# Altium project System Control.PrjPCB (part 1 of 3)
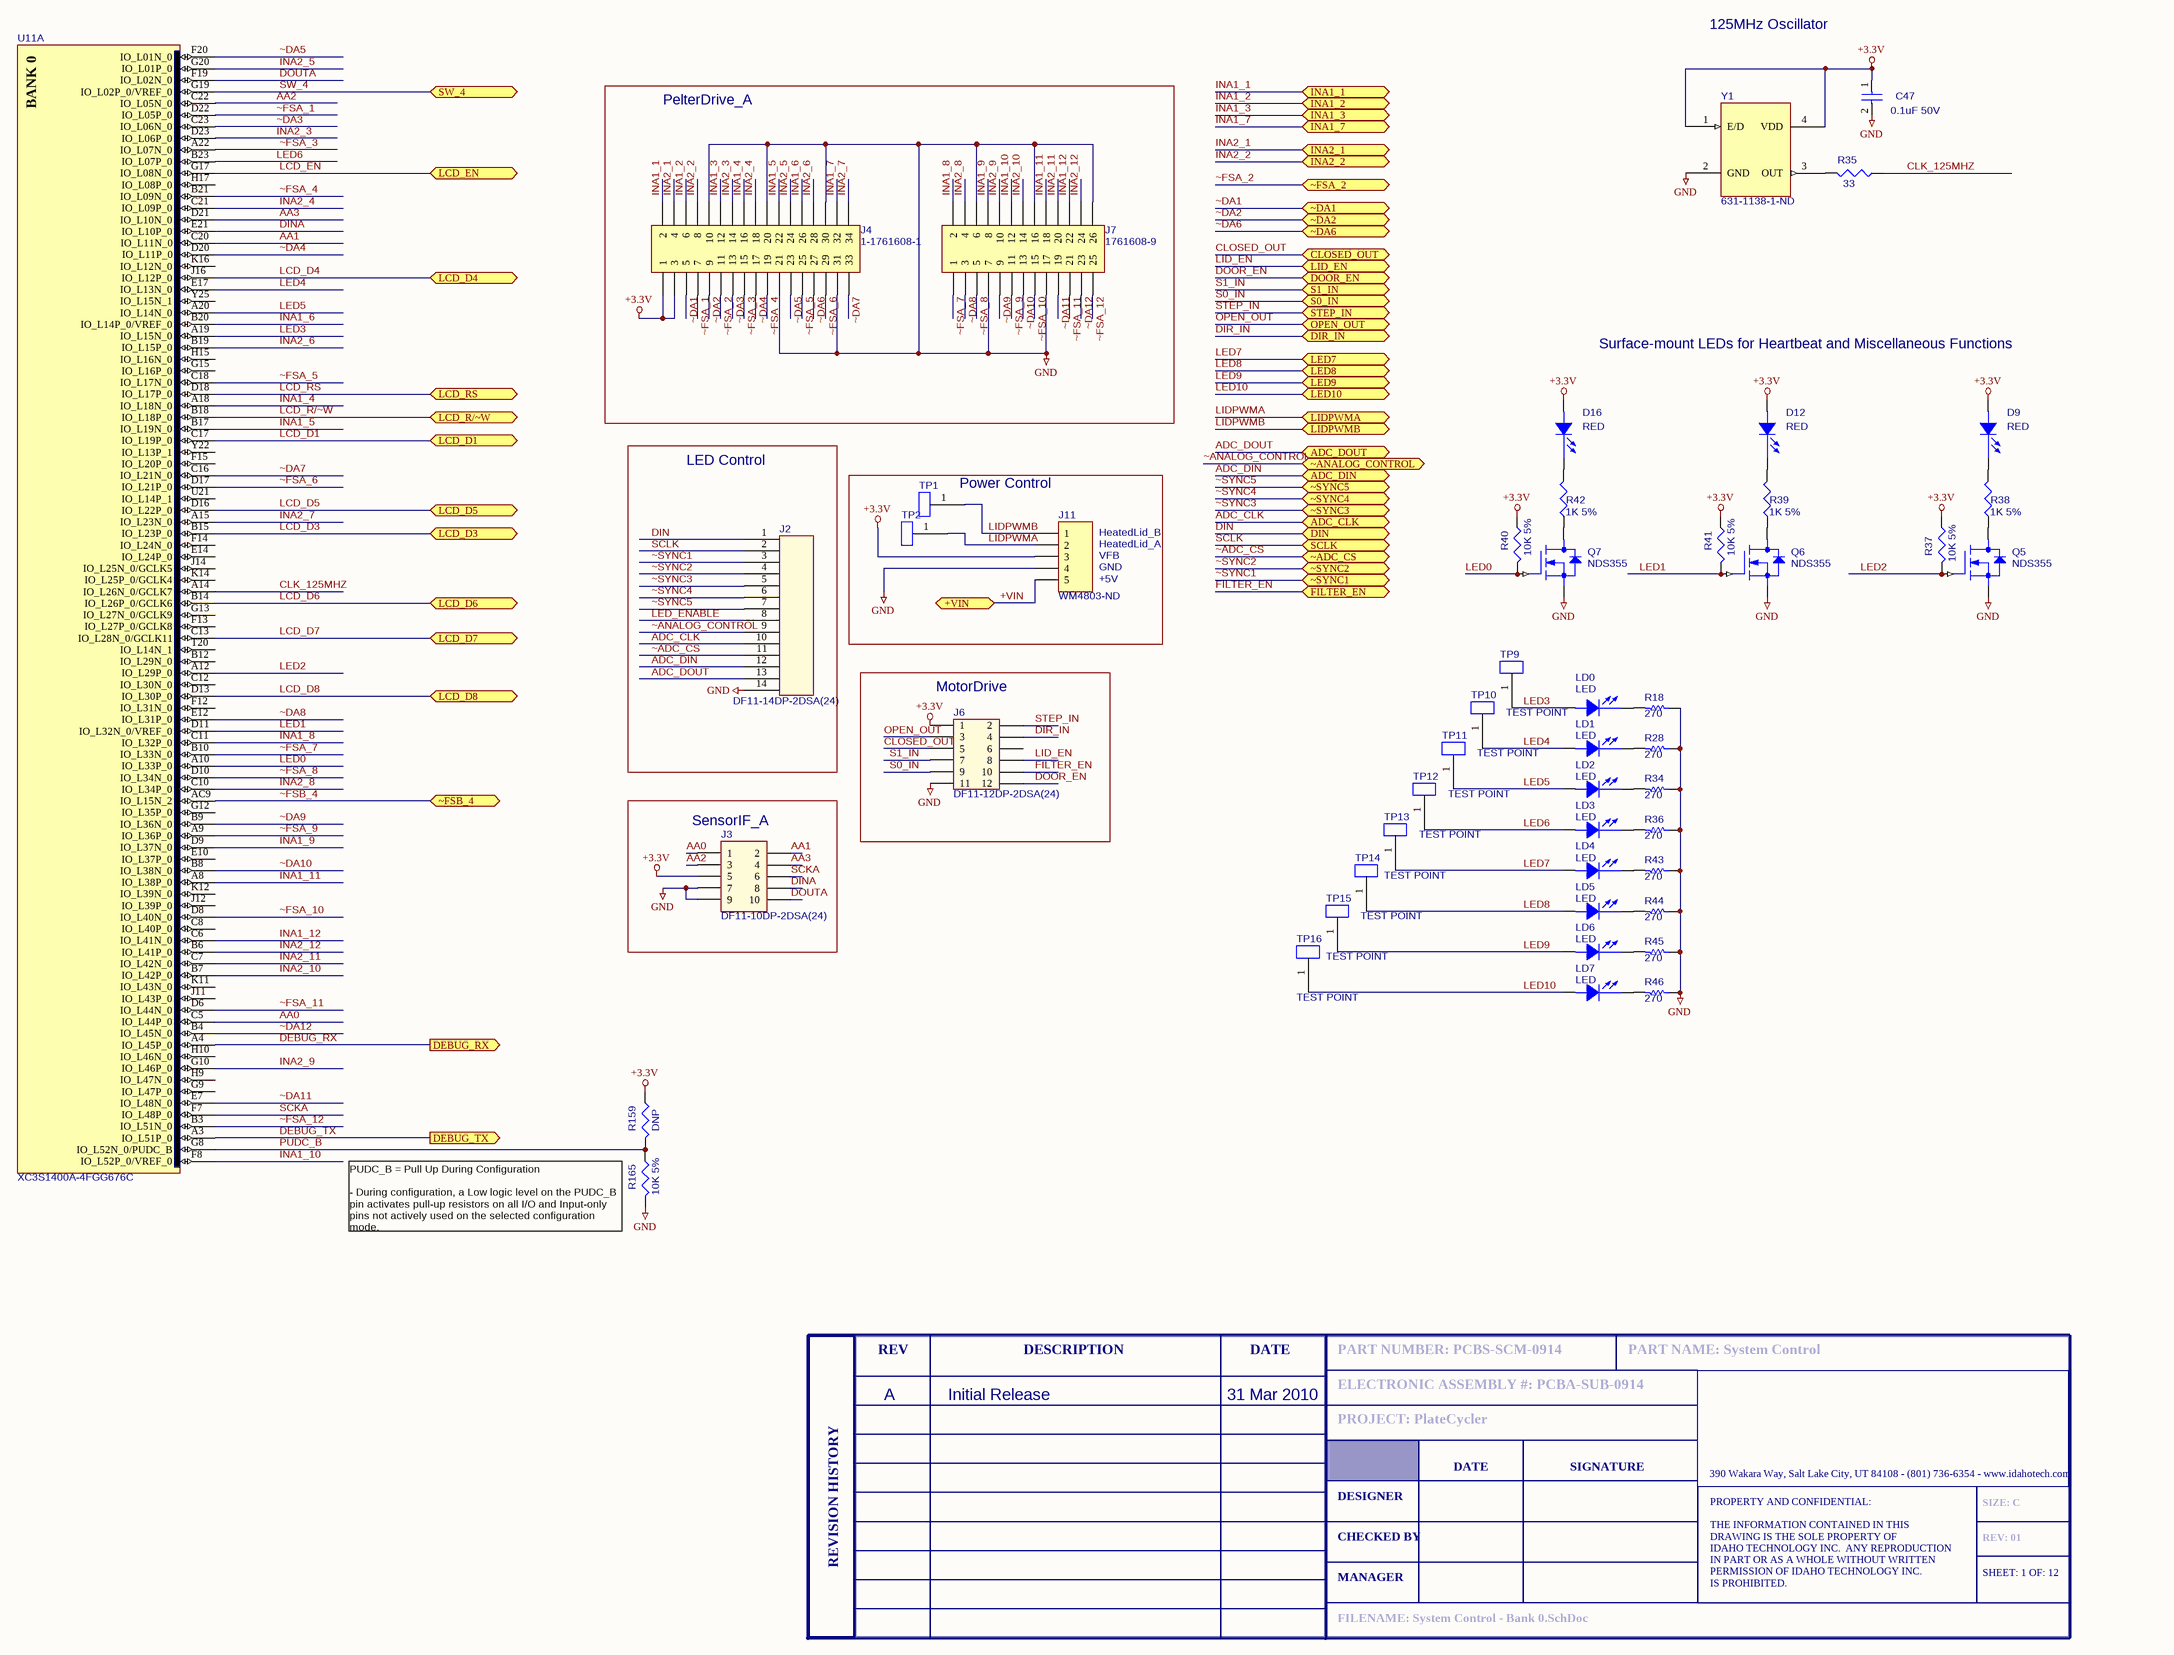
[diagram p0: System Control - Bank0.SchDoc]
Assembly P/N: PCBA-SUB-0914; BOM P/N: PCBS-BOM-0914; BOM Title: FPGA PlateCycler BOM; Project: PlateCycler; Revision Number: C
12 sheets, 515 parts. Net scope: global (net labels, ports and power ports of the same name join across sheets).
Board file: System Control.PcbDoc
Sheets:
  System Control - Bank0.SchDoc
  System Control - Bank1.SchDoc
  System Control - Bank2.SchDoc
  System Control - Bank3.SchDoc
  System Control - FPGA Supply and Configuration.SchDoc
  System Control - Mode DIP Switch.SchDoc
  System Control - Parallel Flash.SchDoc
  System Control - Power Supervisors.SchDoc
  System Control - Power.SchDoc
  System Control - SDRAM.SchDoc
  System Control - Serial Flash.SchDoc
  System Control - Serial Port.SchDoc

## Sheet System Control - Bank0.SchDoc
size C

### Parts
(Parts that share a designator on the sheet are numbered #1, #2 ... from top to bottom, then left to right.)
C47  0.1uF 50V  [SM/C_0603]
D9  RED  [LED 1206]
D12  RED  [LED 1206]
D16  RED  [LED 1206]
J2  Manufacturer P/N: DF11-14DP-2DSA(24)  [HEADER_2X7_1]  (hidden comment: LED Driver)
J3  Manufacturer P/N: DF11-10DP-2DSA(24)  [HEADER_2X5_1]  (hidden comment: Sensor I/F A)
J4  Manufacturer P/N: 1-1761608-1  [HEADER_2X17_2]
J6  Manufacturer P/N: DF11-12DP-2DSA(24)  [HEADER_2X6_1]  (hidden comment: Motor Drive)
J7  Manufacturer P/N: 1761608-9  [HEADER_2X13_2]
J11  Vendor P/N: WM4803-ND  [HDR1X5]  (hidden comment: PWR CONTROL)
LD0  LED  [SM/D_0603]
LD1  LED  [SM/D_0603]
LD2  LED  [SM/D_0603]
LD3  LED  [SM/D_0603]
LD4  LED  [SM/D_0603]
LD5  LED  [SM/D_0603]
LD6  LED  [SM/D_0603]
LD7  LED  [SM/D_0603]
Q5  NDS355  [TO236AA/SOT23]
Q6  NDS355  [TO236AA/SOT23]
Q7  NDS355  [TO236AA/SOT23]
R18  value 270  [0603]  (hidden comment: Res1)
R28  value 270  [0603]  (hidden comment: Res1)
R34  value 270  [0603]  (hidden comment: Res1)
R35  33  [SM/R_0603]
R36  value 270  [0603]  (hidden comment: Res1)
R37  10K 5%  [SM/R_0603]
R38  1K 5%  [SM/R_0603]
R39  1K 5%  [SM/R_0603]
R40  10K 5%  [SM/R_0603]
R41  10K 5%  [SM/R_0603]
R42  1K 5%  [SM/R_0603]
R43  value 270  [0603]  (hidden comment: Res1)
R44  value 270  [0603]  (hidden comment: Res1)
R45  value 270  [0603]  (hidden comment: Res1)
R46  value 270  [0603]  (hidden comment: Res1)
R159  DNP  [SM/R_0603]  (no BOM)
R165  10K 5%  [SM/R_0603]
T?#1  SIZE: C  REV: 01  FILENAME: System Control - Bank 0.SchDoc  PART NUMBER: PCBS-SCM-0914  PART NAME: System Control  ELECTRONIC ASSEMBLY #: PCBA-SUB-0914  PROJECT: PlateCycler  SHEET: 1  OF: 12  (hidden comment: ITI Title Block)  (graphical)
TP1  LID B PWM  [BLKCON.100/VH/TM1SQ/W.100/1]  (value not drawn)
TP2  LID A PWM  [BLKCON.100/VH/TM1SQ/W.100/1]  (value not drawn)
TP9  TEST POINT  [BLKCON.100/VH/TM1SQ/W.100/1]
TP10  TEST POINT  [BLKCON.100/VH/TM1SQ/W.100/1]
TP11  TEST POINT  [BLKCON.100/VH/TM1SQ/W.100/1]
TP12  TEST POINT  [BLKCON.100/VH/TM1SQ/W.100/1]
TP13  TEST POINT  [BLKCON.100/VH/TM1SQ/W.100/1]
TP14  TEST POINT  [BLKCON.100/VH/TM1SQ/W.100/1]
TP15  TEST POINT  [BLKCON.100/VH/TM1SQ/W.100/1]
TP16  TEST POINT  [BLKCON.100/VH/TM1SQ/W.100/1]
U11  XC3S1400A-4FGG676C  [FGG676]  (part A of 9)
Y1  Vendor P/N: 631-1138-1-ND  [FXO_HC73]  (hidden comment: 125 MHz)

### Blocks framed on the sheet
PelterDrive_A: J4 J7
LED Control: J2
Power Control: J11 TP1 TP2
MotorDrive: J6
SensorIF_A: J3

### Ports
+VIN, ADC_CLK, ADC_DIN, ADC_DOUT, CLOSED_OUT, DEBUG_RX, DEBUG_TX, DIN, DIR_IN, DOOR_EN, FILTER_EN, INA1_1, INA1_2, INA1_3, INA1_7, INA2_1, INA2_2, LCD_D1, LCD_D3, LCD_D4, LCD_D5, LCD_D6, LCD_D7, LCD_D8, LCD_EN, LCD_R/~W, LCD_RS, LED7, LED8, LED9, LED10, LID_EN, LIDPWMA, LIDPWMB, OPEN_OUT, S0_IN, S1_IN, SCLK, STEP_IN, SW_4, ~ADC_CS, ~ANALOG_CONTROL, ~DA1, ~DA2, ~DA6, ~FSA_2, ~FSB_4 (bidir), ~SYNC1, ~SYNC2, ~SYNC3, ~SYNC4, ~SYNC5

### Nets
+3.3V: C47.1 D9.1(ANODE) D12.1(ANODE) D16.1(ANODE) J3.5 J4.1 J4.3 J6.1 J11.3 R37.1 R40.1 R41.1 R159.1 Y1.1(E/D) Y1.4(VDD)
GND: C47.2 J2.14 J3.7 J3.9 J4.10 J4.20 J4.21 J4.30 J4.31 J6.11 J7.6 J7.7 J7.16 J7.17 J7.26 J11.4 Q5.2(SOURCE) Q6.2(SOURCE) Q7.2(SOURCE) R18.1 R28.1 R34.1 R36.1 R43.1 R44.1 R45.1 R46.1 R165.2 Y1.2(GND)
+VIN: J11.5 ; port +VIN
AA0: J3.1 U11.C5(IO_L44P_0)
AA1: J3.2 U11.C20(IO_L11N_0)
AA2: J3.3 U11.C22(IO_L05N_0)
AA3: J3.4 U11.D21(IO_L10N_0)
ADC_CLK: J2.10 ; port ADC_CLK
ADC_DIN: J2.12 ; port ADC_DIN
ADC_DOUT: J2.13 ; port ADC_DOUT
CLK_125MHZ: R35.1 U11.A14(IO_L26N_0/GCLK7)
CLOSED_OUT: J6.5 ; port CLOSED_OUT
DEBUG_RX: U11.A4(IO_L45P_0) ; port DEBUG_RX
DEBUG_TX: U11.A3(IO_L51P_0) ; port DEBUG_TX
DIN: J2.1 ; port DIN
DINA: J3.8 U11.E21(IO_L10P_0)
DIR_IN: J6.4 ; port DIR_IN
DOOR_EN: J6.12 ; port DOOR_EN
DOUTA: J3.10 U11.F19(IO_L02N_0)
FILTER_EN: J6.10 ; port FILTER_EN
INA1_1: J4.2 ; port INA1_1
INA1_2: J4.6 ; port INA1_2
INA1_3: J4.12 ; port INA1_3
INA1_4: J4.16 U11.A18(IO_L18N_0)
INA1_5: J4.22 U11.B17(IO_L19N_0)
INA1_6: J4.26 U11.B20(IO_L14P_0/VREF_0)
INA1_7: J4.32 ; port INA1_7
INA1_8: J7.2 U11.C11(IO_L32P_0)
INA1_9: J7.8 U11.D9(IO_L37N_0)
INA1_10: J7.12 U11.F8(IO_L52P_0/VREF_0)
INA1_11: J7.18 U11.A8(IO_L38P_0)
INA1_12: J7.22 U11.C6(IO_L41N_0)
INA2_1: J4.4 ; port INA2_1
INA2_2: J4.8 ; port INA2_2
INA2_3: J4.14 U11.D23(IO_L06P_0)
INA2_4: J4.18 U11.C21(IO_L09P_0)
INA2_5: J4.24 U11.G20(IO_L01P_0)
INA2_6: J4.28 U11.B19(IO_L15P_0)
INA2_7: J4.34 U11.A15(IO_L23N_0)
INA2_8: J7.4 U11.C10(IO_L34P_0)
INA2_9: J7.10 U11.G10(IO_L46P_0)
INA2_10: J7.14 U11.B7(IO_L42P_0)
INA2_11: J7.20 U11.C7(IO_L42N_0)
INA2_12: J7.24 U11.B6(IO_L41P_0)
LCD_D1: U11.C17(IO_L19P_0) ; port LCD_D1
LCD_D3: U11.B15(IO_L23P_0) ; port LCD_D3
LCD_D4: U11.J16(IO_L12P_0) ; port LCD_D4
LCD_D5: U11.D16(IO_L22P_0) ; port LCD_D5
LCD_D6: U11.B14(IO_L26P_0/GCLK6) ; port LCD_D6
LCD_D7: U11.C13(IO_L28N_0/GCLK11) ; port LCD_D7
LCD_D8: U11.D13(IO_L30P_0) ; port LCD_D8
LCD_EN: U11.G17(IO_L08N_0) ; port LCD_EN
LCD_R/~W: U11.B18(IO_L18P_0) ; port LCD_R/~W
LCD_RS: U11.D18(IO_L17P_0) ; port LCD_RS
LED0: Q7.1(GATE) R40.2 U11.A10(IO_L33P_0)
LED1: Q6.1(GATE) R41.2 U11.D11(IO_L32N_0/VREF_0)
LED2: Q5.1(GATE) R37.2 U11.A12(IO_L29P_0)
LED3: LD0.1(ANODE) TP9.1 U11.A19(IO_L15N_0)
LED4: LD1.1(ANODE) TP10.1 U11.E17(IO_L13N_0)
LED5: LD2.1(ANODE) TP11.1 U11.A20(IO_L14N_0)
LED6: LD3.1(ANODE) TP12.1 U11.B23(IO_L07P_0)
LED7: LD4.1(ANODE) TP13.1 ; port LED7
LED8: LD5.1(ANODE) TP14.1 ; port LED8
LED9: LD6.1(ANODE) TP15.1 ; port LED9
LED10: LD7.1(ANODE) TP16.1 ; port LED10
LED_ENABLE: J2.8
LID_EN: J6.8 ; port LID_EN
LIDPWMA: J11.2 TP2.1 ; port LIDPWMA
LIDPWMB: J11.1 TP1.1 ; port LIDPWMB
OPEN_OUT: J6.3 ; port OPEN_OUT
PUDC_B: R159.2 R165.1 U11.G8(IO_L52N_0/PUDC_B)
S0_IN: J6.9 ; port S0_IN
S1_IN: J6.7 ; port S1_IN
SCKA: J3.6 U11.F7(IO_L48P_0)
SCLK: J2.2 ; port SCLK
STEP_IN: J6.2 ; port STEP_IN
SW_4: U11.G19(IO_L02P_0/VREF_0) ; port SW_4
~ADC_CS: J2.11 ; port ~ADC_CS
~ANALOG_CONTROL: J2.9 ; port ~ANALOG_CONTROL
~DA1: J4.5 ; port ~DA1
~DA2: J4.9 ; port ~DA2
~DA3: J4.13 U11.C23(IO_L06N_0)
~DA4: J4.17 U11.D20(IO_L11P_0)
~DA5: J4.23 U11.F20(IO_L01N_0)
~DA6: J4.27 ; port ~DA6
~DA7: J4.33 U11.C16(IO_L21N_0)
~DA8: J7.3 U11.E12(IO_L31P_0)
~DA9: J7.9 U11.B9(IO_L36N_0)
~DA10: J7.13 U11.B8(IO_L38N_0)
~DA11: J7.19 U11.E7(IO_L48N_0)
~DA12: J7.23 U11.B4(IO_L45N_0)
~FSA_1: J4.7 U11.D22(IO_L05P_0)
~FSA_2: J4.11 ; port ~FSA_2
~FSA_3: J4.15 U11.A22(IO_L07N_0)
~FSA_4: J4.19 U11.B21(IO_L09N_0)
~FSA_5: J4.25 U11.C18(IO_L17N_0)
~FSA_6: J4.29 U11.D17(IO_L21P_0)
~FSA_7: J7.1 U11.B10(IO_L33N_0)
~FSA_8: J7.5 U11.D10(IO_L34N_0)
~FSA_9: J7.11 U11.A9(IO_L36P_0)
~FSA_10: J7.15 U11.D8(IO_L40N_0)
~FSA_11: J7.21 U11.D6(IO_L44N_0)
~FSA_12: J7.25 U11.B3(IO_L51N_0)
~FSB_4: U11.AC9(IO_L15N_2) ; port ~FSB_4
~SYNC1: J2.3 ; port ~SYNC1
~SYNC2: J2.4 ; port ~SYNC2
~SYNC3: J2.5 ; port ~SYNC3
~SYNC4: J2.6 ; port ~SYNC4
~SYNC5: J2.7 ; port ~SYNC5
NetD9_2: D9.2(CATHODE) R38.2
NetD12_2: D12.2(CATHODE) R39.2
NetD16_2: D16.2(CATHODE) R42.2
NetLD0_2: LD0.2(CATHODE) R18.2
NetLD1_2: LD1.2(CATHODE) R28.2
NetLD2_2: LD2.2(CATHODE) R34.2
NetLD3_2: LD3.2(CATHODE) R36.2
NetLD4_2: LD4.2(CATHODE) R43.2
NetLD5_2: LD5.2(CATHODE) R44.2
NetLD6_2: LD6.2(CATHODE) R45.2
NetLD7_2: LD7.2(CATHODE) R46.2
NetQ5_3: Q5.3(DRAIN) R38.1
NetQ6_3: Q6.3(DRAIN) R39.1
NetQ7_3: Q7.3(DRAIN) R42.1
NetR35_2: R35.2 Y1.3(OUT)

Not connected (* = marked no-connect by the designer): J6 6; U11 B12(IO_L29N_0) C8(IO_L40P_0) C12(IO_L30N_0) E10(IO_L37P_0) E14(IO_L24P_0) F12(IO_L31N_0) F13(IO_L27P_0/GCLK8) F14(IO_L24N_0) F15(IO_L20P_0) G9(IO_L47P_0) G12(IO_L35P_0) G13(IO_L27N_0/GCLK9) G15(IO_L16P_0) H9(IO_L47N_0) H10(IO_L46N_0) H15(IO_L16N_0) H17(IO_L08P_0) J11(IO_L43P_0) J12(IO_L39P_0) J14(IO_L25N_0/GCLK5) K11(IO_L43N_0) K12(IO_L39N_0) K14(IO_L25P_0/GCLK4) K16(IO_L12N_0) T20(IO_L14N_1) U21(IO_L14P_1) Y22(IO_L13P_1) Y25(IO_L15N_1)

### Notes on the sheet
- 125MHz Oscillator
- Surface-mount LEDs for Heartbeat and Miscellaneous Functions
- (near J11) HeatedLid_B
- (near J11) HeatedLid_A
- (near J11) VFB
- (near J11) GND
- (near J11) +5V
- PUDC_B = Pull Up During Configuration
  - During configuration, a Low logic level on the PUDC_B pin activates pull-up resistors on all I/O and Input-only pins not actively used on the selected configuration mode.
- A
- Initial Release
- 31 Mar 2010
- (in symbol ITI TITLE BLOCK AND REVISION TABLE) REV; DESCRIPTION; DATE; SIGNATURE; 390 Wakara Way, Salt Lake City, UT 84108 - (801) 736-6354 - www.idahotech.com; DESIGNER; CHECKED BY; REVISION HISTORY; MANAGER; PROPERTY AND CONFIDENTIAL: / THE INFORMATION CONTAINED IN THIS / DRAWING IS THE SOLE PROPERTY OF / IDAHO TECHNOLOGY INC.  ANY REPRODUCTION / IN PART OR AS A WHOLE WITHOUT WRITTEN / PERMISSION OF IDAHO TECHNOLOGY INC. / IS PROHIBITED.
- (in symbol XC3S1400A-4FGG676C, part A) BANK 0

### Library data of the parts
C47 = CAP NP_1: CAP CER .10UF 50V X7R 0603; Manufacturer P/N: UMK107B7104KA-T; Manufacturer: Taiyo Yuden; Vendor P/N: 587-1243-1-ND; Vendor: Digikey
D9 D12 D16 = LED: LED 635NM RED WTR CLR 1206 SMD; Manufacturer: Lumex; Manufacturer P/N: SML-LX1206IC-TR; Vendor: Digikey; Vendor P/N: 67-1356-1-ND
J2 = 14 pin Hirose: CONN HEADER 14POS 2MM PCB TIN; Manufacturer: Hirose; Vendor: Digikey; Vendor P/N: H10234-ND
J3 = HEADER_2X5_1: CONN HEADER 10POS 2MM PCB TIN; Manufacturer: HIROSE; Vendor: DIGIKEY; Vendor P/N: H10232-ND; Price: 0.65
J4 = Header 17X2: CONN HEADER LOPRO STR .100 34POS; Manufacturer: Tyco; Vendor: Digikey; Vendor P/N: A31188-ND
J6 = HEADER_2X6_1: CONN HEADER 12POS 2MM PCB TIN; Manufacturer: HIROSE; Vendor: DIGIKEY; Vendor P/N: H10233-ND; Price: 0.72
J7 = Header 13X2: CONN HEADER LOPRO STR .100 26POS; Manufacturer: Tyco; Vendor: Digikey; Vendor P/N: A31187-ND; Price: 5.26
J11 = Header 5: CONN HEADER 5POS .100 VERT GOLD; Manufacturer: Molex; Manufacturer P/N: 70543-0004; Vendor: Digikey; Desc: CONN HEADER 5POS .100 VERT GOLD; Price: 1.41
LD0-LD7 = LED: LED 565NM GRN DIFF 0603 SMD; Manufacturer: Lumex Opto/Components Inc; Manufacturer P/N: SML-LX0603GW-TR; Vendor: Digikey; Vendor P/N: 67-1549-1-ND
Q5-Q7 = NDS355N/SOT: MOSFET N-CH 30V 1.6A SOT-23; Manufacturer: Fairchild Semiconductor; Vendor: Digikey; Vendor P/N: NDS355NCT-ND; Manufacturer P/N: NDS355N
R18 R28 R34 R36 R43-R46 = Res1: RES 270 OHM 1/10W 5% 0603 SMD; Manufacturer: Panasonic; Manufacturer P/N: ERJ-3GEYJ271V; Vendor: DIGIKEY; Vendor P/N: P270GCT-ND; IT P/N: N/A; Price: 0.71
R35 = R10K 5% 0603: RES 33 OHM 1/10W 5% 0603 SMD; Manufacturer: Panasonic; Manufacturer P/N: ERJ-3GEYJ330V; Vendor: Digikey; Vendor P/N: P33GCT-ND
R37 R40 R41 R159 R165 = R10K 5% 0603: RES 10K OHM 1/10W 5% 0603 SMD; Manufacturer: Panasonic; Manufacturer P/N: ERJ-3GEYJ103V; Vendor: Digikey; Vendor P/N: P10KGCT-ND
R38 R39 R42 = R1K 5% 0603: RES 1.0K OHM 1/10W 5% 0603 SMD; Manufacturer: Panasonic; Manufacturer P/N: ERJ-3GEYJ102V; Vendor: Digikey; Vendor P/N: P1.0KGCT-ND
T?#1 = ITI TITLE BLOCK AND REVISION TABLE
TP1 TP2 TP9-TP16 = TEST POINT: TEST POINT PC MINI .040"D RED; Manufacturer P/N: 5000; Manufacturer: Keystone Electronics; Vendor P/N: 5000K-ND; Vendor: Digikey
U11 = XC3S1400A-4FGG676C: IC, SPARTAN-3A, FPGA, 1400K, 656FBGA; Manufacturer: Xilinx Inc; Vendor: Digikey; Vendor P/N: 122-1551-ND; Published: 12-Dec-2006; DatasheetVersion: 08-May-2007; PackageVersion: ver1.2.1, Apr-2005; PackageReference: FGG676; Publisher: Altium Limited; PackageDescription: 676-Ball Fine Pitch Ball Grid Array (FGG676) - Pb-Free; Code_JEDEC: MS-034-AAL-1; Code_IPC: BGA100P26X26-676; ComponentLink1Description: Manufacturer Link; ComponentLink1URL: http://www.xilinx.com/products/silicon_solutions/fpgas/spartan_series/spartan3a_fpgas/index.htm; ComponentLink2Description: Datasheet; ComponentLink2URL: http://direct.xilinx.com/bvdocs/publications/ds529.pdf; Desc: IC, SPARTAN-3A, FPGA, 1400K, 656FBGA; Manufacturer P/N: XC3S1400A-4FGG676C
Y1 = FXO-HC73: OSC 125.0000 MHZ 3.3V HCMOS SMT; Manufacturer P/N: FXO-HC735-125MHZ; Manufacturer: FOX Electronics; Vendor: Digikey

## Sheet System Control - Bank1.SchDoc
size C
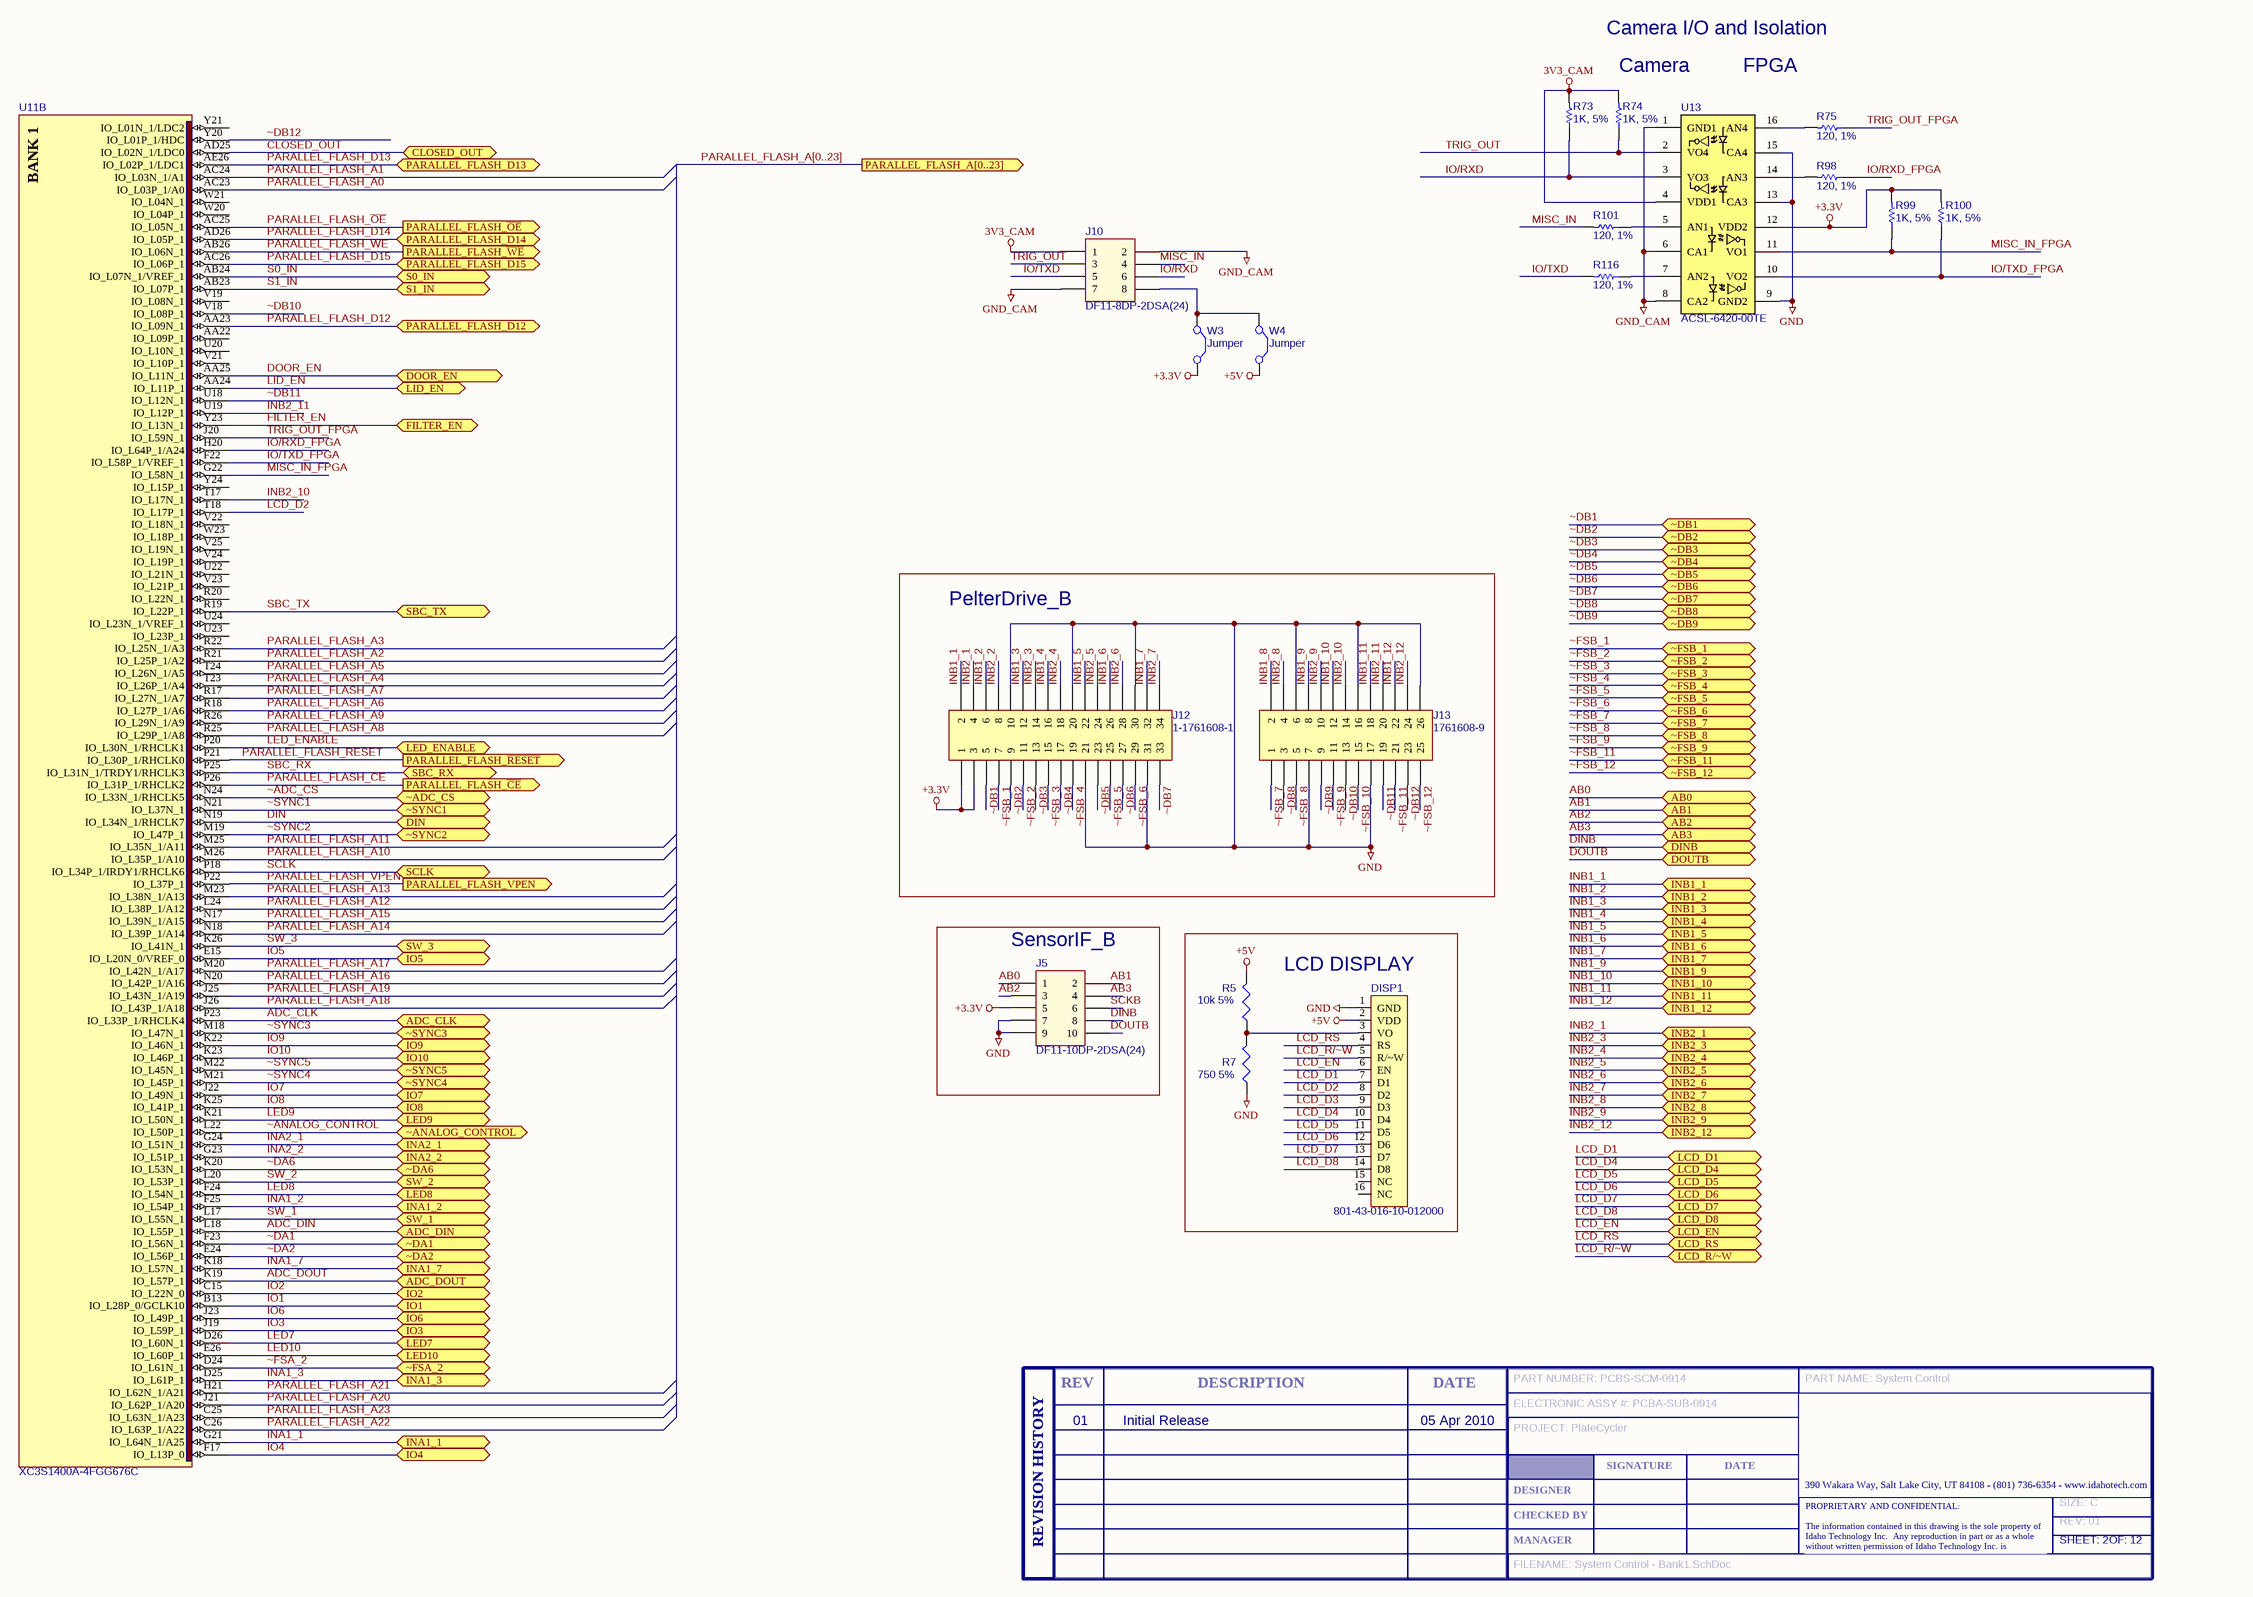
[diagram p1: System Control - Bank1.SchDoc]

### Parts
(Parts that share a designator on the sheet are numbered #1, #2 ... from top to bottom, then left to right.)
DISP1  Manufacturer P/N: 801-43-016-10-012000  [LCD_HEADER_16X2_2 - SIMPLE]  (hidden comment: LCD_HEADER_1X16_1)
J5  Manufacturer P/N: DF11-10DP-2DSA(24)  [HEADER_2X5_1]  (hidden comment: Sensor I/F B)
J10  Manufacturer P/N: DF11-8DP-2DSA(24)  [HEADER_2X4_1]  (hidden comment: HEADER_2X4_1)
J12  Manufacturer P/N: 1-1761608-1  [HEADER_2X17_2]
J13  Manufacturer P/N: 1761608-9  [HEADER_2X13_2]
R5  10k 5%  [0603]
R7  750 5%  [0603]
R73  value 1K, 5%  [0603]  (hidden comment: Res1)
R74  value 1K, 5%  [0603]  (hidden comment: Res1)
R75  value 120, 1%  [0603]  (hidden comment: Res1)
R98  value 120, 1%  [0603]  (hidden comment: Res1)
R99  value 1K, 5%  [0603]  (hidden comment: Res1)
R100  value 1K, 5%  [0603]  (hidden comment: Res1)
R101  value 120, 1%  [0603]  (hidden comment: Res1)
R116  value 120, 1%  [0603]  (hidden comment: Res1)
T?#2  SIZE: C  REV: 01  FILENAME: System Control - Bank1.SchDoc  PART NUMBER: PCBS-SCM-0914  PART NAME: System Control  ELECTRONIC ASSY #: PCBA-SUB-0914  PROJECT: PlateCycler  SHEET: 2  OF: 12  (hidden comment: ITI Title Block, A Size)  (graphical)
U11  XC3S1400A-4FGG676C  [FGG676]  (part B of 9)
U13  Manufacturer P/N: ACSL-6420-00TE  [SO-16_SMALL_OUTLINE]  (hidden comment: OPTO_ISO_4_1)
W3  Jumper  [HDR1X2]
W4  Jumper  [HDR1X2]

### Blocks framed on the sheet
PelterDrive_B: J12 J13
SensorIF_B: J5
LCD DISPLAY: DISP1 R5 R7

### Ports
AB0, AB1, AB2, AB3, ADC_CLK, ADC_DIN, ADC_DOUT, CLOSED_OUT, DIN, DINB, DOOR_EN, DOUTB, FILTER_EN, INA1_1, INA1_2, INA1_3, INA1_7, INA2_1, INA2_2, INB1_1, INB1_2, INB1_3, INB1_4, INB1_5, INB1_6, INB1_7, INB1_9, INB1_10, INB1_11, INB1_12, INB2_1, INB2_3, INB2_4, INB2_5, INB2_6, INB2_7, INB2_8, INB2_9, INB2_12, IO1, IO2, IO3, IO4, IO5, IO6, IO7, IO8, IO9, IO10, LCD_D1, LCD_D4, LCD_D5, LCD_D6, LCD_D7, LCD_D8, LCD_EN, LCD_R/~W, LCD_RS, LED7, LED8, LED9, LED10, LED_ENABLE, LID_EN, PARALLEL_FLASH_A[0..23] (out), PARALLEL_FLASH_D12, PARALLEL_FLASH_D13, PARALLEL_FLASH_D14, PARALLEL_FLASH_D15, PARALLEL_FLASH_VPEN (out), PARALLEL_FLASH_~{CE} (out), PARALLEL_FLASH_~{OE} (out), PARALLEL_FLASH_~{RESET} (out), PARALLEL_FLASH_~{WE} (out), S0_IN, S1_IN, SBC_RX, SBC_TX, SCLK, SW_1, SW_2, SW_3, ~ADC_CS, ~ANALOG_CONTROL, ~DA1, ~DA2, ~DA6, ~DB1, ~DB2, ~DB3, ~DB4, ~DB5, ~DB6, ~DB7, ~DB8, ~DB9, ~FSA_2, ~FSB_1, ~FSB_2, ~FSB_3, ~FSB_4 (bidir), ~FSB_5, ~FSB_6, ~FSB_7, ~FSB_8, ~FSB_9, ~FSB_11, ~FSB_12, ~SYNC1, ~SYNC2, ~SYNC3, ~SYNC4, ~SYNC5

### Nets
3V3_CAM: J10.1 R73.2 R74.2 U13.4(VDD1)
+3.3V: J5.5 J12.1 J12.3 R99.2 R100.2 U13.12(VDD2) W3.2(C2)
+5V: DISP1.2(VDD) R5.2 W4.2(C2)
GND: DISP1.1(GND) J5.7 J5.9 J12.10 J12.20 J12.21 J12.30 J12.31 J13.6 J13.7 J13.16 J13.17 J13.26 R7.1 U13.9(GND2) U13.13(CA3) U13.15(CA4)
GND_CAM: J10.2 J10.7 U13.1(GND1) U13.6(CA1) U13.8(CA2)
AB0: J5.1 ; port AB0
AB1: J5.2 ; port AB1
AB2: J5.3 ; port AB2
AB3: J5.4 ; port AB3
ADC_CLK: U11.P23(IO_L33P_1/RHCLK4) ; port ADC_CLK
ADC_DIN: U11.L18(IO_L55P_1) ; port ADC_DIN
ADC_DOUT: U11.K19(IO_L57P_1) ; port ADC_DOUT
CLOSED_OUT: U11.AD25(IO_L02N_1/LDC0) ; port CLOSED_OUT
DIN: U11.N19(IO_L34N_1/RHCLK7) ; port DIN
DINB: J5.8 ; port DINB
DOOR_EN: U11.AA25(IO_L11N_1) ; port DOOR_EN
DOUTB: J5.10 ; port DOUTB
FILTER_EN: U11.Y23(IO_L13N_1) ; port FILTER_EN
INA1_1: U11.G21(IO_L64N_1/A25) ; port INA1_1
INA1_2: U11.F25(IO_L54P_1) ; port INA1_2
INA1_3: U11.D25(IO_L61P_1) ; port INA1_3
INA1_7: U11.K18(IO_L57N_1) ; port INA1_7
INA2_1: U11.G24(IO_L51N_1) ; port INA2_1
INA2_2: U11.G23(IO_L51P_1) ; port INA2_2
INB1_1: J12.2 ; port INB1_1
INB1_2: J12.6 ; port INB1_2
INB1_3: J12.12 ; port INB1_3
INB1_4: J12.16 ; port INB1_4
INB1_5: J12.22 ; port INB1_5
INB1_6: J12.26 ; port INB1_6
INB1_7: J12.32 ; port INB1_7
INB1_8: J13.2
INB1_9: J13.8 ; port INB1_9
INB1_10: J13.12 ; port INB1_10
INB1_11: J13.18 ; port INB1_11
INB1_12: J13.22 ; port INB1_12
INB2_1: J12.4 ; port INB2_1
INB2_2: J12.8
INB2_3: J12.14 ; port INB2_3
INB2_4: J12.18 ; port INB2_4
INB2_5: J12.24 ; port INB2_5
INB2_6: J12.28 ; port INB2_6
INB2_7: J12.34 ; port INB2_7
INB2_8: J13.4 ; port INB2_8
INB2_9: J13.10 ; port INB2_9
INB2_10: J13.14 U11.T17(IO_L17N_1)
INB2_11: J13.20 U11.U19(IO_L12P_1)
INB2_12: J13.24 ; port INB2_12
IO1: U11.B13(IO_L28P_0/GCLK10) ; port IO1
IO2: U11.C15(IO_L22N_0) ; port IO2
IO3: U11.J19(IO_L59P_1) ; port IO3
IO4: U11.F17(IO_L13P_0) ; port IO4
IO5: U11.E15(IO_L20N_0/VREF_0) ; port IO5
IO6: U11.J23(IO_L49P_1) ; port IO6
IO7: U11.J22(IO_L49N_1) ; port IO7
IO8: U11.K25(IO_L41P_1) ; port IO8
IO9: U11.K22(IO_L46N_1) ; port IO9
IO10: U11.K23(IO_L46P_1) ; port IO10
IO/RXD: J10.6 R73.1 U13.3(VO3)
IO/RXD_FPGA: R98.1 U11.H20(IO_L64P_1/A24)
IO/TXD: J10.5 R116.2
IO/TXD_FPGA: R100.1 U11.F22(IO_L58P_1/VREF_1) U13.10(VO2)
LCD_D1: DISP1.7(D1) ; port LCD_D1
LCD_D2: DISP1.8(D2) U11.T18(IO_L17P_1)
LCD_D3: DISP1.9(D3)
LCD_D4: DISP1.10(D4) ; port LCD_D4
LCD_D5: DISP1.11(D5) ; port LCD_D5
LCD_D6: DISP1.12(D6) ; port LCD_D6
LCD_D7: DISP1.13(D7) ; port LCD_D7
LCD_D8: DISP1.14(D8) ; port LCD_D8
LCD_EN: DISP1.6(EN) ; port LCD_EN
LCD_R/~W: DISP1.5(R/~W) ; port LCD_R/~W
LCD_RS: DISP1.4(RS) ; port LCD_RS
LED7: U11.D26(IO_L60N_1) ; port LED7
LED8: U11.F24(IO_L54N_1) ; port LED8
LED9: U11.K21(IO_L50N_1) ; port LED9
LED10: U11.E26(IO_L60P_1) ; port LED10
LED_ENABLE: U11.P20(IO_L30N_1/RHCLK1) ; port LED_ENABLE
LID_EN: U11.AA24(IO_L11P_1) ; port LID_EN
MISC_IN: J10.4 R101.2
MISC_IN_FPGA: R99.1 U11.G22(IO_L58N_1) U13.11(VO1)
PARALLEL_FLASH_A0: U11.AC23(IO_L03P_1/A0)
PARALLEL_FLASH_A1: U11.AC24(IO_L03N_1/A1)
PARALLEL_FLASH_A2: U11.R21(IO_L25P_1/A2)
PARALLEL_FLASH_A3: U11.R22(IO_L25N_1/A3)
PARALLEL_FLASH_A4: U11.T23(IO_L26P_1/A4)
PARALLEL_FLASH_A5: U11.T24(IO_L26N_1/A5)
PARALLEL_FLASH_A6: U11.R18(IO_L27P_1/A6)
PARALLEL_FLASH_A7: U11.R17(IO_L27N_1/A7)
PARALLEL_FLASH_A8: U11.R25(IO_L29P_1/A8)
PARALLEL_FLASH_A9: U11.R26(IO_L29N_1/A9)
PARALLEL_FLASH_A10: U11.M26(IO_L35P_1/A10)
PARALLEL_FLASH_A11: U11.M25(IO_L35N_1/A11)
PARALLEL_FLASH_A12: U11.L24(IO_L38P_1/A12)
PARALLEL_FLASH_A13: U11.M23(IO_L38N_1/A13)
PARALLEL_FLASH_A14: U11.N18(IO_L39P_1/A14)
PARALLEL_FLASH_A15: U11.N17(IO_L39N_1/A15)
PARALLEL_FLASH_A16: U11.N20(IO_L42P_1/A16)
PARALLEL_FLASH_A17: U11.M20(IO_L42N_1/A17)
PARALLEL_FLASH_A18: U11.J26(IO_L43P_1/A18)
PARALLEL_FLASH_A19: U11.J25(IO_L43N_1/A19)
PARALLEL_FLASH_A20: U11.J21(IO_L62P_1/A20)
PARALLEL_FLASH_A21: U11.H21(IO_L62N_1/A21)
PARALLEL_FLASH_A22: U11.C26(IO_L63P_1/A22)
PARALLEL_FLASH_A23: U11.C25(IO_L63N_1/A23)
PARALLEL_FLASH_~{CE}: U11.P26(IO_L31P_1/RHCLK2) ; port PARALLEL_FLASH_~{CE}
PARALLEL_FLASH_D12: U11.AA23(IO_L09N_1) ; port PARALLEL_FLASH_D12
PARALLEL_FLASH_D13: U11.AE26(IO_L02P_1/LDC1) ; port PARALLEL_FLASH_D13
PARALLEL_FLASH_D14: U11.AD26(IO_L05P_1) ; port PARALLEL_FLASH_D14
PARALLEL_FLASH_D15: U11.AC26(IO_L06P_1) ; port PARALLEL_FLASH_D15
PARALLEL_FLASH_~{OE}: U11.AC25(IO_L05N_1) ; port PARALLEL_FLASH_~{OE}
PARALLEL_FLASH_~{RESET}: U11.P21(IO_L30P_1/RHCLK0) ; port PARALLEL_FLASH_~{RESET}
PARALLEL_FLASH_VPEN: U11.P22(IO_L37P_1) ; port PARALLEL_FLASH_VPEN
PARALLEL_FLASH_~{WE}: U11.AB26(IO_L06N_1) ; port PARALLEL_FLASH_~{WE}
S0_IN: U11.AB24(IO_L07N_1/VREF_1) ; port S0_IN
S1_IN: U11.AB23(IO_L07P_1) ; port S1_IN
SBC_RX: U11.P25(IO_L31N_1/TRDY1/RHCLK3) ; port SBC_RX
SBC_TX: U11.R19(IO_L22P_1) ; port SBC_TX
SCKB: J5.6
SCLK: U11.P18(IO_L34P_1/IRDY1/RHCLK6) ; port SCLK
SW_1: U11.L17(IO_L55N_1) ; port SW_1
SW_2: U11.L20(IO_L53P_1) ; port SW_2
SW_3: U11.K26(IO_L41N_1) ; port SW_3
TRIG_OUT: J10.3 R74.1 U13.2(VO4)
TRIG_OUT_FPGA: R75.1 U11.J20(IO_L59N_1)
~ADC_CS: U11.N24(IO_L33N_1/RHCLK5) ; port ~ADC_CS
~ANALOG_CONTROL: U11.L22(IO_L50P_1) ; port ~ANALOG_CONTROL
~DA1: U11.F23(IO_L56N_1) ; port ~DA1
~DA2: U11.E24(IO_L56P_1) ; port ~DA2
~DA6: U11.K20(IO_L53N_1) ; port ~DA6
~DB1: J12.5 ; port ~DB1
~DB2: J12.9 ; port ~DB2
~DB3: J12.13 ; port ~DB3
~DB4: J12.17 ; port ~DB4
~DB5: J12.23 ; port ~DB5
~DB6: J12.27 ; port ~DB6
~DB7: J12.33 ; port ~DB7
~DB8: J13.3 ; port ~DB8
~DB9: J13.9 ; port ~DB9
~DB10: J13.13 U11.V18(IO_L08P_1)
~DB11: J13.19 U11.U18(IO_L12N_1)
~DB12: J13.23 U11.Y20(IO_L01P_1/HDC)
~FSA_2: U11.D24(IO_L61N_1) ; port ~FSA_2
~FSB_1: J12.7 ; port ~FSB_1
~FSB_2: J12.11 ; port ~FSB_2
~FSB_3: J12.15 ; port ~FSB_3
~FSB_4: J12.19 ; port ~FSB_4
~FSB_5: J12.25 ; port ~FSB_5
~FSB_6: J12.29 ; port ~FSB_6
~FSB_7: J13.1 ; port ~FSB_7
~FSB_8: J13.5 ; port ~FSB_8
~FSB_9: J13.11 ; port ~FSB_9
~FSB_10: J13.15
~FSB_11: J13.21 ; port ~FSB_11
~FSB_12: J13.25 ; port ~FSB_12
~SYNC1: U11.N21(IO_L37N_1) ; port ~SYNC1
~SYNC2: U11.M19(IO_L47P_1) ; port ~SYNC2
~SYNC3: U11.M18(IO_L47N_1) ; port ~SYNC3
~SYNC4: U11.M21(IO_L45P_1) ; port ~SYNC4
~SYNC5: U11.M22(IO_L45N_1) ; port ~SYNC5
NetDISP1_3: DISP1.3(VO) R5.1 R7.2
NetJ10_8: J10.8 W3.1(C1) W4.1(C1)
NetR75_2: R75.2 U13.16(AN4)
NetR98_2: R98.2 U13.14(AN3)
NetR101_1: R101.1 U13.5(AN1)
NetR116_1: R116.1 U13.7(AN2)

Not connected (* = marked no-connect by the designer): DISP1 15(NC) 16(NC); U11 AA22(IO_L09P_1) R20(IO_L22N_1) U20(IO_L10N_1) U22(IO_L21N_1) U23(IO_L23P_1) U24(IO_L23N_1/VREF_1) V19(IO_L08N_1) V21(IO_L10P_1) V22(IO_L18N_1) V23(IO_L21P_1) V24(IO_L19P_1) V25(IO_L19N_1) W20(IO_L04P_1) W21(IO_L04N_1) W23(IO_L18P_1) Y21(IO_L01N_1/LDC2) Y24(IO_L15P_1)

### Buses and harness runs
bus PARALLEL_FLASH_A[0..23] = port PARALLEL_FLASH_A[0..23]

### Notes on the sheet
- Camera I/O and Isolation
- (near R74) Camera
- FPGA
- 01
- Initial Release
- 05 Apr 2010
- (in symbol ITI A-size Title Block and Rev Table) REV; DESCRIPTION; DATE; SIGNATURE; 390 Wakara Way, Salt Lake City, UT 84108 - (801) 736-6354 - www.idahotech.com; DESIGNER; CHECKED BY; REVISION HISTORY; MANAGER; PROPRIETARY AND CONFIDENTIAL: / The information contained in this drawing is the sole property of / Idaho Technology Inc.  Any reproduction in part or as a whole / without written permission of Idaho Technology Inc. is prohibited.
- (in symbol XC3S1400A-4FGG676C, part B) BANK 1

### Library data of the parts
DISP1 = LCD_HEADER_1X16_1: CONN SOCKET STRIP LOPRO 16 PIN; Manufacturer: MILL-MAX CORP; Vendor: DIGIKEY; Vendor P/N: ED6516-ND; NOTE: FOR USE WITH LUMEX LCM-S01602DTR/A 16X2 CHARACTER LCD DISPLAY (DIGIKEY 67-1779-ND); Price: 3.32
J5 = HEADER_2X5_1: as J3 on sheet System Control - Bank0; Price: 0.65
J10 = HEADER_2X4_1: CONN HEADER 8POS 2MM PCB TIN; Manufacturer: HIROSE; Vendor: DIGIKEY; Vendor P/N: H10231-ND; Price: 0.57
J12 = Header 17X2: as J4 on sheet System Control - Bank0
J13 = Header 13X2: as J7 on sheet System Control - Bank0; Price: 5.26
R5 = RESISTOR_0_Dup1: RES 10K OHM 1/10W 5% 0603 SMD; Manufacturer: Panasonic; Manufacturer P/N: ERJ-3GEYJ103V; Vendor: Digikey; Vendor P/N: P10KGCT-ND
R7 = RESISTOR_0_Dup1: RES 750 OHM 1/10W 5% 0603 SMD; Manufacturer: Panasonic; Manufacturer P/N: ERJ-3GEYJ751V; Vendor: Digikey; Vendor P/N: P750GCT-ND
R73 R74 R99 R100 = Res1: RES 1.0K OHM 1/10W 5% 0603 SMD; Manufacturer: PANASONIC - ECG; Manufacturer P/N: ERJ-3GEYJ102V; Vendor: DIGIKEY; Vendor P/N: P1.0KGCT-ND; IT P/N: N/A; Price: 0.71
R75 R98 R101 R116 = Res1: RES 120 OHM 1/10W 1% 0603 SMD; Manufacturer: PANASONIC - ECG; Manufacturer P/N: ERJ-3EKF1200V; Vendor: DIGIKEY; Vendor P/N: P120HCT-ND; IT P/N: N/A; Price: 0.073
T?#2 = ITI A-size Title Block and Rev Table: ITI Title Block and Rev Table, A Size
U11 = XC3S1400A-4FGG676C: Spartan-3A  I/O Optimized FPGA, 502 User I/Os, 676-Pin Pb-Free FBGA, Standard Performance, Commercial Grade; Published: 12-Dec-2006; DatasheetVersion: 08-May-2007; PackageVersion: ver1.2.1, Apr-2005; PackageReference: FGG676; Publisher: Altium Limited; PackageDescription: 676-Ball Fine Pitch Ball Grid Array (FGG676) - Pb-Free; Code_JEDEC: MS-034-AAL-1; Code_IPC: BGA100P26X26-676; ComponentLink1Description: Manufacturer Link; ComponentLink1URL: http://www.xilinx.com/products/silicon_solutions/fpgas/spartan_series/spartan3a_fpgas/index.htm; ComponentLink2Description: Datasheet; ComponentLink2URL: http://direct.xilinx.com/bvdocs/publications/ds529.pdf
U13 = OPTO_ISO_4_1: IC, OPTOCOUPLER, QUAD, BIDIR, 16-SOIC; Manufacturer: AVAGO TECHNOLOGIES; Vendor: DIGIKEY; Vendor P/N: 516-1733-5-ND; Price: 8.10
W3 W4 = Jumper: CONN HEADER 2POS .100" STR TIN; Manufacturer: Molex; Manufacturer P/N: 90120-0122; Vendor: Digikey; Vendor P/N: WM8072-ND; Published: 24-Mar-1999; LatestRevisionDate: 17-Jul-2002; LatestRevisionNote: Re-released for DXP Platform.; PackageReference: RAD-0.2; Publisher: Altium Limited

## Sheet System Control - Bank2.SchDoc
size C
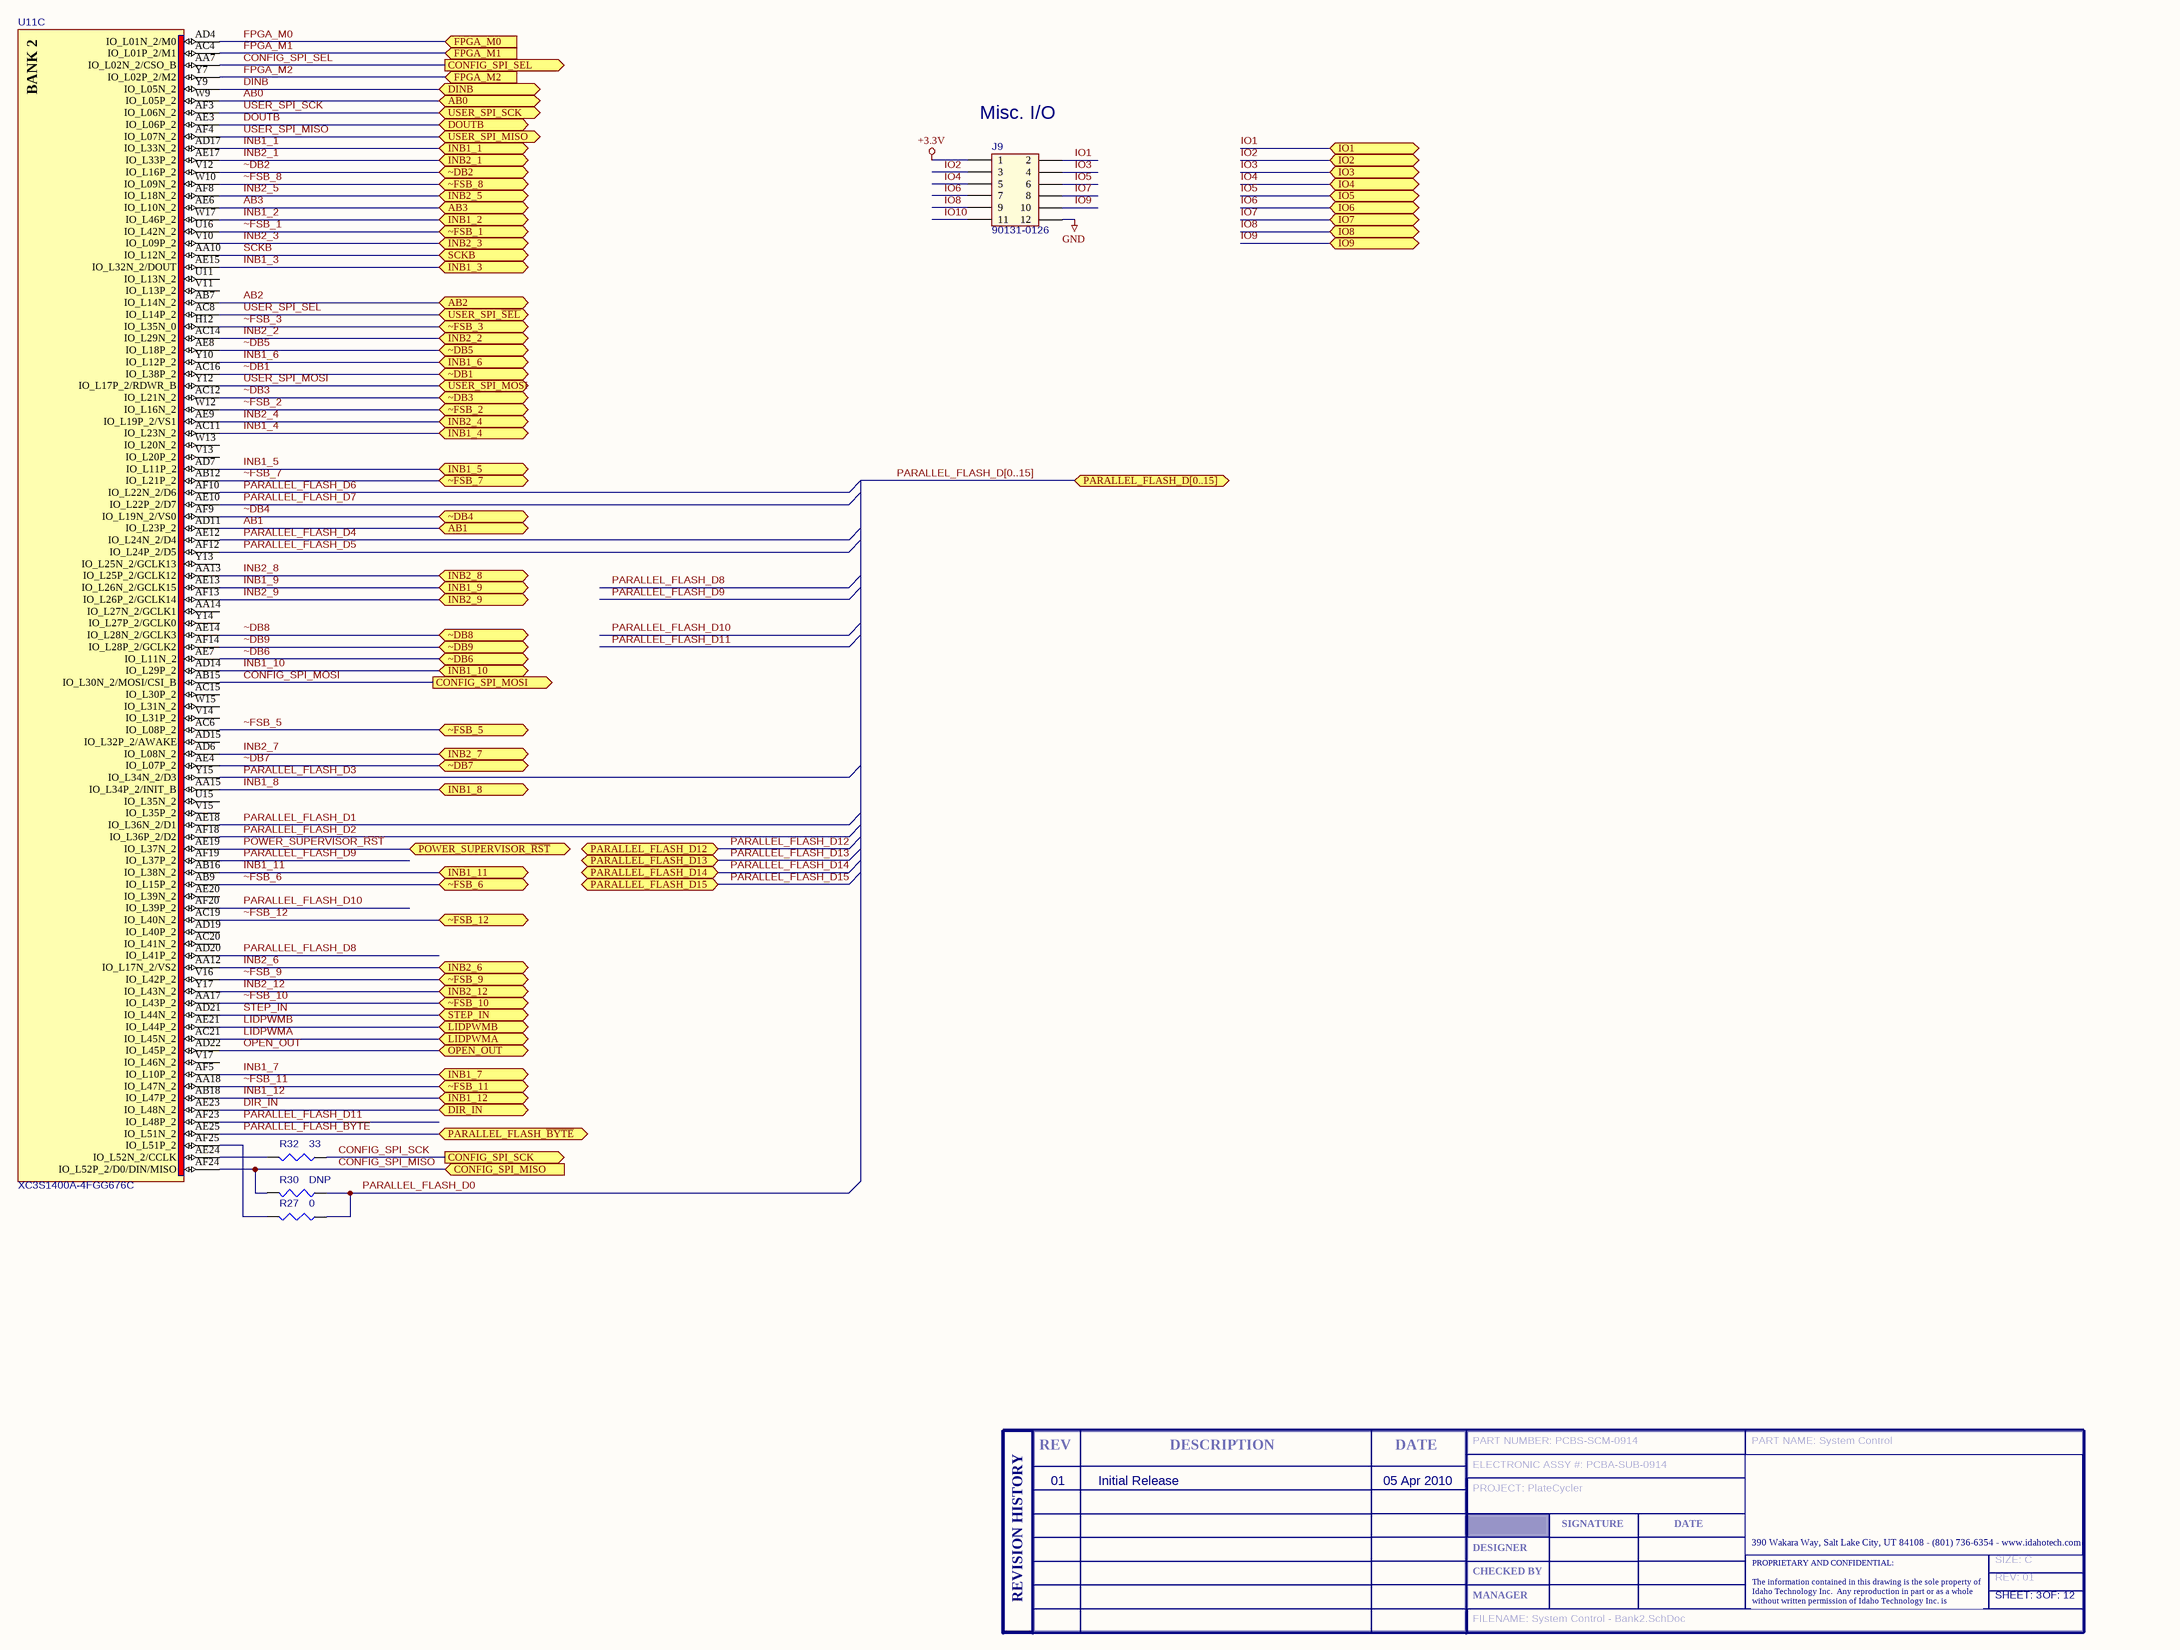
[diagram p2: System Control - Bank2.SchDoc]

### Parts
(Parts that share a designator on the sheet are numbered #1, #2 ... from top to bottom, then left to right.)
J9  Manufacturer P/N: 90131-0126  [HEADER_2X6_2]  (hidden comment: HEADER_2X6_1)
R27  0  [SM/R_0603]
R30  DNP  [SM/R_0603]  (no BOM)
R32  33  [SM/R_0603]
T?#3  SIZE: C  REV: 01  FILENAME: System Control - Bank2.SchDoc  PART NUMBER: PCBS-SCM-0914  PART NAME: System Control  ELECTRONIC ASSY #: PCBA-SUB-0914  PROJECT: PlateCycler  SHEET: 3  OF: 12  (hidden comment: ITI Title Block, A Size)  (graphical)
U11  XC3S1400A-4FGG676C  [FGG676]  (part C of 9)

### Ports
AB0, AB1, AB2, AB3, CONFIG_SPI_MISO (in), CONFIG_SPI_MOSI (out), CONFIG_SPI_SCK (out), CONFIG_SPI_SEL (out), DINB, DIR_IN, DOUTB, FPGA_M0 (in), FPGA_M1 (in), FPGA_M2 (in), INB1_1, INB1_2, INB1_3, INB1_4, INB1_5, INB1_6, INB1_7, INB1_8, INB1_9, INB1_10, INB1_11, INB1_12, INB2_1, INB2_2, INB2_3, INB2_4, INB2_5, INB2_6, INB2_7, INB2_8, INB2_9, INB2_12, IO1, IO2, IO3, IO4, IO5, IO6, IO7, IO8, IO9, LIDPWMA, LIDPWMB, OPEN_OUT, PARALLEL_FLASH_D12, PARALLEL_FLASH_D13, PARALLEL_FLASH_D14, PARALLEL_FLASH_D15, PARALLEL_FLASH_D[0..15] (bidir), PARALLEL_FLASH_~{BYTE}, POWER_SUPERVISOR_~{RST}, SCKB, STEP_IN, USER_SPI_MISO, USER_SPI_MOSI, USER_SPI_SCK, USER_SPI_~{SEL}, ~DB1, ~DB2, ~DB3, ~DB4, ~DB5, ~DB6, ~DB7, ~DB8, ~DB9, ~FSB_1, ~FSB_2, ~FSB_3, ~FSB_5, ~FSB_6, ~FSB_7, ~FSB_8, ~FSB_9, ~FSB_10, ~FSB_11, ~FSB_12

### Nets
+3.3V: J9.1
GND: J9.12
AB0: U11.W9(IO_L05P_2) ; port AB0
AB1: U11.AD11(IO_L23P_2) ; port AB1
AB2: U11.AB7(IO_L14N_2) ; port AB2
AB3: U11.AE6(IO_L10N_2) ; port AB3
CONFIG_SPI_MISO: R30.2 U11.AF24(IO_L52P_2/D0/DIN/MISO) ; port CONFIG_SPI_MISO
CONFIG_SPI_MOSI: U11.AB15(IO_L30N_2/MOSI/CSI_B) ; port CONFIG_SPI_MOSI
CONFIG_SPI_SCK: R32.1 ; port CONFIG_SPI_SCK
CONFIG_SPI_SEL: U11.AA7(IO_L02N_2/CSO_B) ; port CONFIG_SPI_SEL
DINB: U11.Y9(IO_L05N_2) ; port DINB
DIR_IN: U11.AE23(IO_L48N_2) ; port DIR_IN
DOUTB: U11.AE3(IO_L06P_2) ; port DOUTB
FPGA_M0: U11.AD4(IO_L01N_2/M0) ; port FPGA_M0
FPGA_M1: U11.AC4(IO_L01P_2/M1) ; port FPGA_M1
FPGA_M2: U11.Y7(IO_L02P_2/M2) ; port FPGA_M2
INB1_1: U11.AD17(IO_L33N_2) ; port INB1_1
INB1_2: U11.W17(IO_L46P_2) ; port INB1_2
INB1_3: U11.AE15(IO_L32N_2/DOUT) ; port INB1_3
INB1_4: U11.AC11(IO_L23N_2) ; port INB1_4
INB1_5: U11.AD7(IO_L11P_2) ; port INB1_5
INB1_6: U11.Y10(IO_L12P_2) ; port INB1_6
INB1_7: U11.AF5(IO_L10P_2) ; port INB1_7
INB1_8: U11.AA15(IO_L34P_2/INIT_B) ; port INB1_8
INB1_9: U11.AE13(IO_L26N_2/GCLK15) ; port INB1_9
INB1_10: U11.AD14(IO_L29P_2) ; port INB1_10
INB1_11: U11.AB16(IO_L38N_2) ; port INB1_11
INB1_12: U11.AB18(IO_L47P_2) ; port INB1_12
INB2_1: U11.AE17(IO_L33P_2) ; port INB2_1
INB2_2: U11.AC14(IO_L29N_2) ; port INB2_2
INB2_3: U11.V10(IO_L09P_2) ; port INB2_3
INB2_4: U11.AE9(IO_L19P_2/VS1) ; port INB2_4
INB2_5: U11.AF8(IO_L18N_2) ; port INB2_5
INB2_6: U11.AA12(IO_L17N_2/VS2) ; port INB2_6
INB2_7: U11.AD6(IO_L08N_2) ; port INB2_7
INB2_8: U11.AA13(IO_L25P_2/GCLK12) ; port INB2_8
INB2_9: U11.AF13(IO_L26P_2/GCLK14) ; port INB2_9
INB2_12: U11.Y17(IO_L43N_2) ; port INB2_12
IO1: J9.2 ; port IO1
IO2: J9.3 ; port IO2
IO3: J9.4 ; port IO3
IO4: J9.5 ; port IO4
IO5: J9.6 ; port IO5
IO6: J9.7 ; port IO6
IO7: J9.8 ; port IO7
IO8: J9.9 ; port IO8
IO9: J9.10 ; port IO9
IO10: J9.11
LIDPWMA: U11.AC21(IO_L45N_2) ; port LIDPWMA
LIDPWMB: U11.AE21(IO_L44P_2) ; port LIDPWMB
OPEN_OUT: U11.AD22(IO_L45P_2) ; port OPEN_OUT
PARALLEL_FLASH_~{BYTE}: U11.AE25(IO_L51N_2) ; port PARALLEL_FLASH_~{BYTE}
PARALLEL_FLASH_D0: R27.1 R30.1
PARALLEL_FLASH_D1: U11.AE18(IO_L36N_2/D1)
PARALLEL_FLASH_D2: U11.AF18(IO_L36P_2/D2)
PARALLEL_FLASH_D3: U11.Y15(IO_L34N_2/D3)
PARALLEL_FLASH_D4: U11.AE12(IO_L24N_2/D4)
PARALLEL_FLASH_D5: U11.AF12(IO_L24P_2/D5)
PARALLEL_FLASH_D6: U11.AF10(IO_L22N_2/D6)
PARALLEL_FLASH_D7: U11.AE10(IO_L22P_2/D7)
PARALLEL_FLASH_D8: U11.AD20(IO_L41P_2)
PARALLEL_FLASH_D9: U11.AF19(IO_L37P_2)
PARALLEL_FLASH_D10: U11.AF20(IO_L39P_2)
PARALLEL_FLASH_D11: U11.AF23(IO_L48P_2)
POWER_SUPERVISOR_~{RST}: U11.AE19(IO_L37N_2) ; port POWER_SUPERVISOR_~{RST}
SCKB: U11.AA10(IO_L12N_2) ; port SCKB
STEP_IN: U11.AD21(IO_L44N_2) ; port STEP_IN
USER_SPI_MISO: U11.AF4(IO_L07N_2) ; port USER_SPI_MISO
USER_SPI_MOSI: U11.Y12(IO_L17P_2/RDWR_B) ; port USER_SPI_MOSI
USER_SPI_~{SEL}: U11.AC8(IO_L14P_2) ; port USER_SPI_~{SEL}
USER_SPI_SCK: U11.AF3(IO_L06N_2) ; port USER_SPI_SCK
~DB1: U11.AC16(IO_L38P_2) ; port ~DB1
~DB2: U11.V12(IO_L16P_2) ; port ~DB2
~DB3: U11.AC12(IO_L21N_2) ; port ~DB3
~DB4: U11.AF9(IO_L19N_2/VS0) ; port ~DB4
~DB5: U11.AE8(IO_L18P_2) ; port ~DB5
~DB6: U11.AE7(IO_L11N_2) ; port ~DB6
~DB7: U11.AE4(IO_L07P_2) ; port ~DB7
~DB8: U11.AE14(IO_L28N_2/GCLK3) ; port ~DB8
~DB9: U11.AF14(IO_L28P_2/GCLK2) ; port ~DB9
~FSB_1: U11.U16(IO_L42N_2) ; port ~FSB_1
~FSB_2: U11.W12(IO_L16N_2) ; port ~FSB_2
~FSB_3: U11.H12(IO_L35N_0) ; port ~FSB_3
~FSB_5: U11.AC6(IO_L08P_2) ; port ~FSB_5
~FSB_6: U11.AB9(IO_L15P_2) ; port ~FSB_6
~FSB_7: U11.AB12(IO_L21P_2) ; port ~FSB_7
~FSB_8: U11.W10(IO_L09N_2) ; port ~FSB_8
~FSB_9: U11.V16(IO_L42P_2) ; port ~FSB_9
~FSB_10: U11.AA17(IO_L43P_2) ; port ~FSB_10
~FSB_11: U11.AA18(IO_L47N_2) ; port ~FSB_11
~FSB_12: U11.AC19(IO_L40N_2) ; port ~FSB_12
NetR27_2: R27.2 U11.AF25(IO_L51P_2)
NetR32_2: R32.2 U11.AE24(IO_L52N_2/CCLK)

Not connected (* = marked no-connect by the designer): U11 AA14(IO_L27N_2/GCLK1) AC15(IO_L30P_2) AC20(IO_L41N_2) AD15(IO_L32P_2/AWAKE) AD19(IO_L40P_2) AE20(IO_L39N_2) U11(IO_L13N_2) U15(IO_L35N_2) V11(IO_L13P_2) V13(IO_L20P_2) V14(IO_L31P_2) V15(IO_L35P_2) V17(IO_L46N_2) W13(IO_L20N_2) W15(IO_L31N_2) Y13(IO_L25N_2/GCLK13) Y14(IO_L27P_2/GCLK0)

### Buses and harness runs
bus PARALLEL_FLASH_D[0..15] = port PARALLEL_FLASH_D[0..15]

### Notes on the sheet
- (near J9) Misc. I/O
- 01
- Initial Release
- 05 Apr 2010
- (in symbol ITI A-size Title Block and Rev Table) REV; DESCRIPTION; DATE; SIGNATURE; 390 Wakara Way, Salt Lake City, UT 84108 - (801) 736-6354 - www.idahotech.com; DESIGNER; CHECKED BY; REVISION HISTORY; MANAGER; PROPRIETARY AND CONFIDENTIAL: / The information contained in this drawing is the sole property of / Idaho Technology Inc.  Any reproduction in part or as a whole / without written permission of Idaho Technology Inc. is prohibited.
- (in symbol XC3S1400A-4FGG676C, part C) BANK 2

### Library data of the parts
J9 = HEADER_2X6_1: CONN HEADER 12POS .100" STR TIN; Manufacturer: MOLEX; Vendor: DIGIKEY; Vendor P/N: WM8124-ND; Desc: CONN HEADER 12POS .100" STR TIN; Price: 1.28
R27 R30 = R0 5% 0603: RES ZERO OHM 1/10W 5% 0603 SMD; Manufacturer: Panasonic; Manufacturer P/N: ERJ-3GEY0R00V; Vendor: Digikey; Vendor P/N: P0.0GCT-ND
R32 = R10K 5% 0603: as R35 on sheet System Control - Bank0
T?#3 = ITI A-size Title Block and Rev Table: ITI Title Block and Rev Table, A Size
U11 = XC3S1400A-4FGG676C: as U11 on sheet System Control - Bank1; Published: 12-Dec-2006; DatasheetVersion: 08-May-2007; PackageVersion: ver1.2.1, Apr-2005; PackageReference: FGG676; Publisher: Altium Limited; PackageDescription: 676-Ball Fine Pitch Ball Grid Array (FGG676) - Pb-Free; Code_JEDEC: MS-034-AAL-1; Code_IPC: BGA100P26X26-676; ComponentLink1Description: Manufacturer Link; ComponentLink1URL: http://www.xilinx.com/products/silicon_solutions/fpgas/spartan_series/spartan3a_fpgas/index.htm; ComponentLink2Description: Datasheet; ComponentLink2URL: http://direct.xilinx.com/bvdocs/publications/ds529.pdf

## Sheet System Control - Bank3.SchDoc
size C
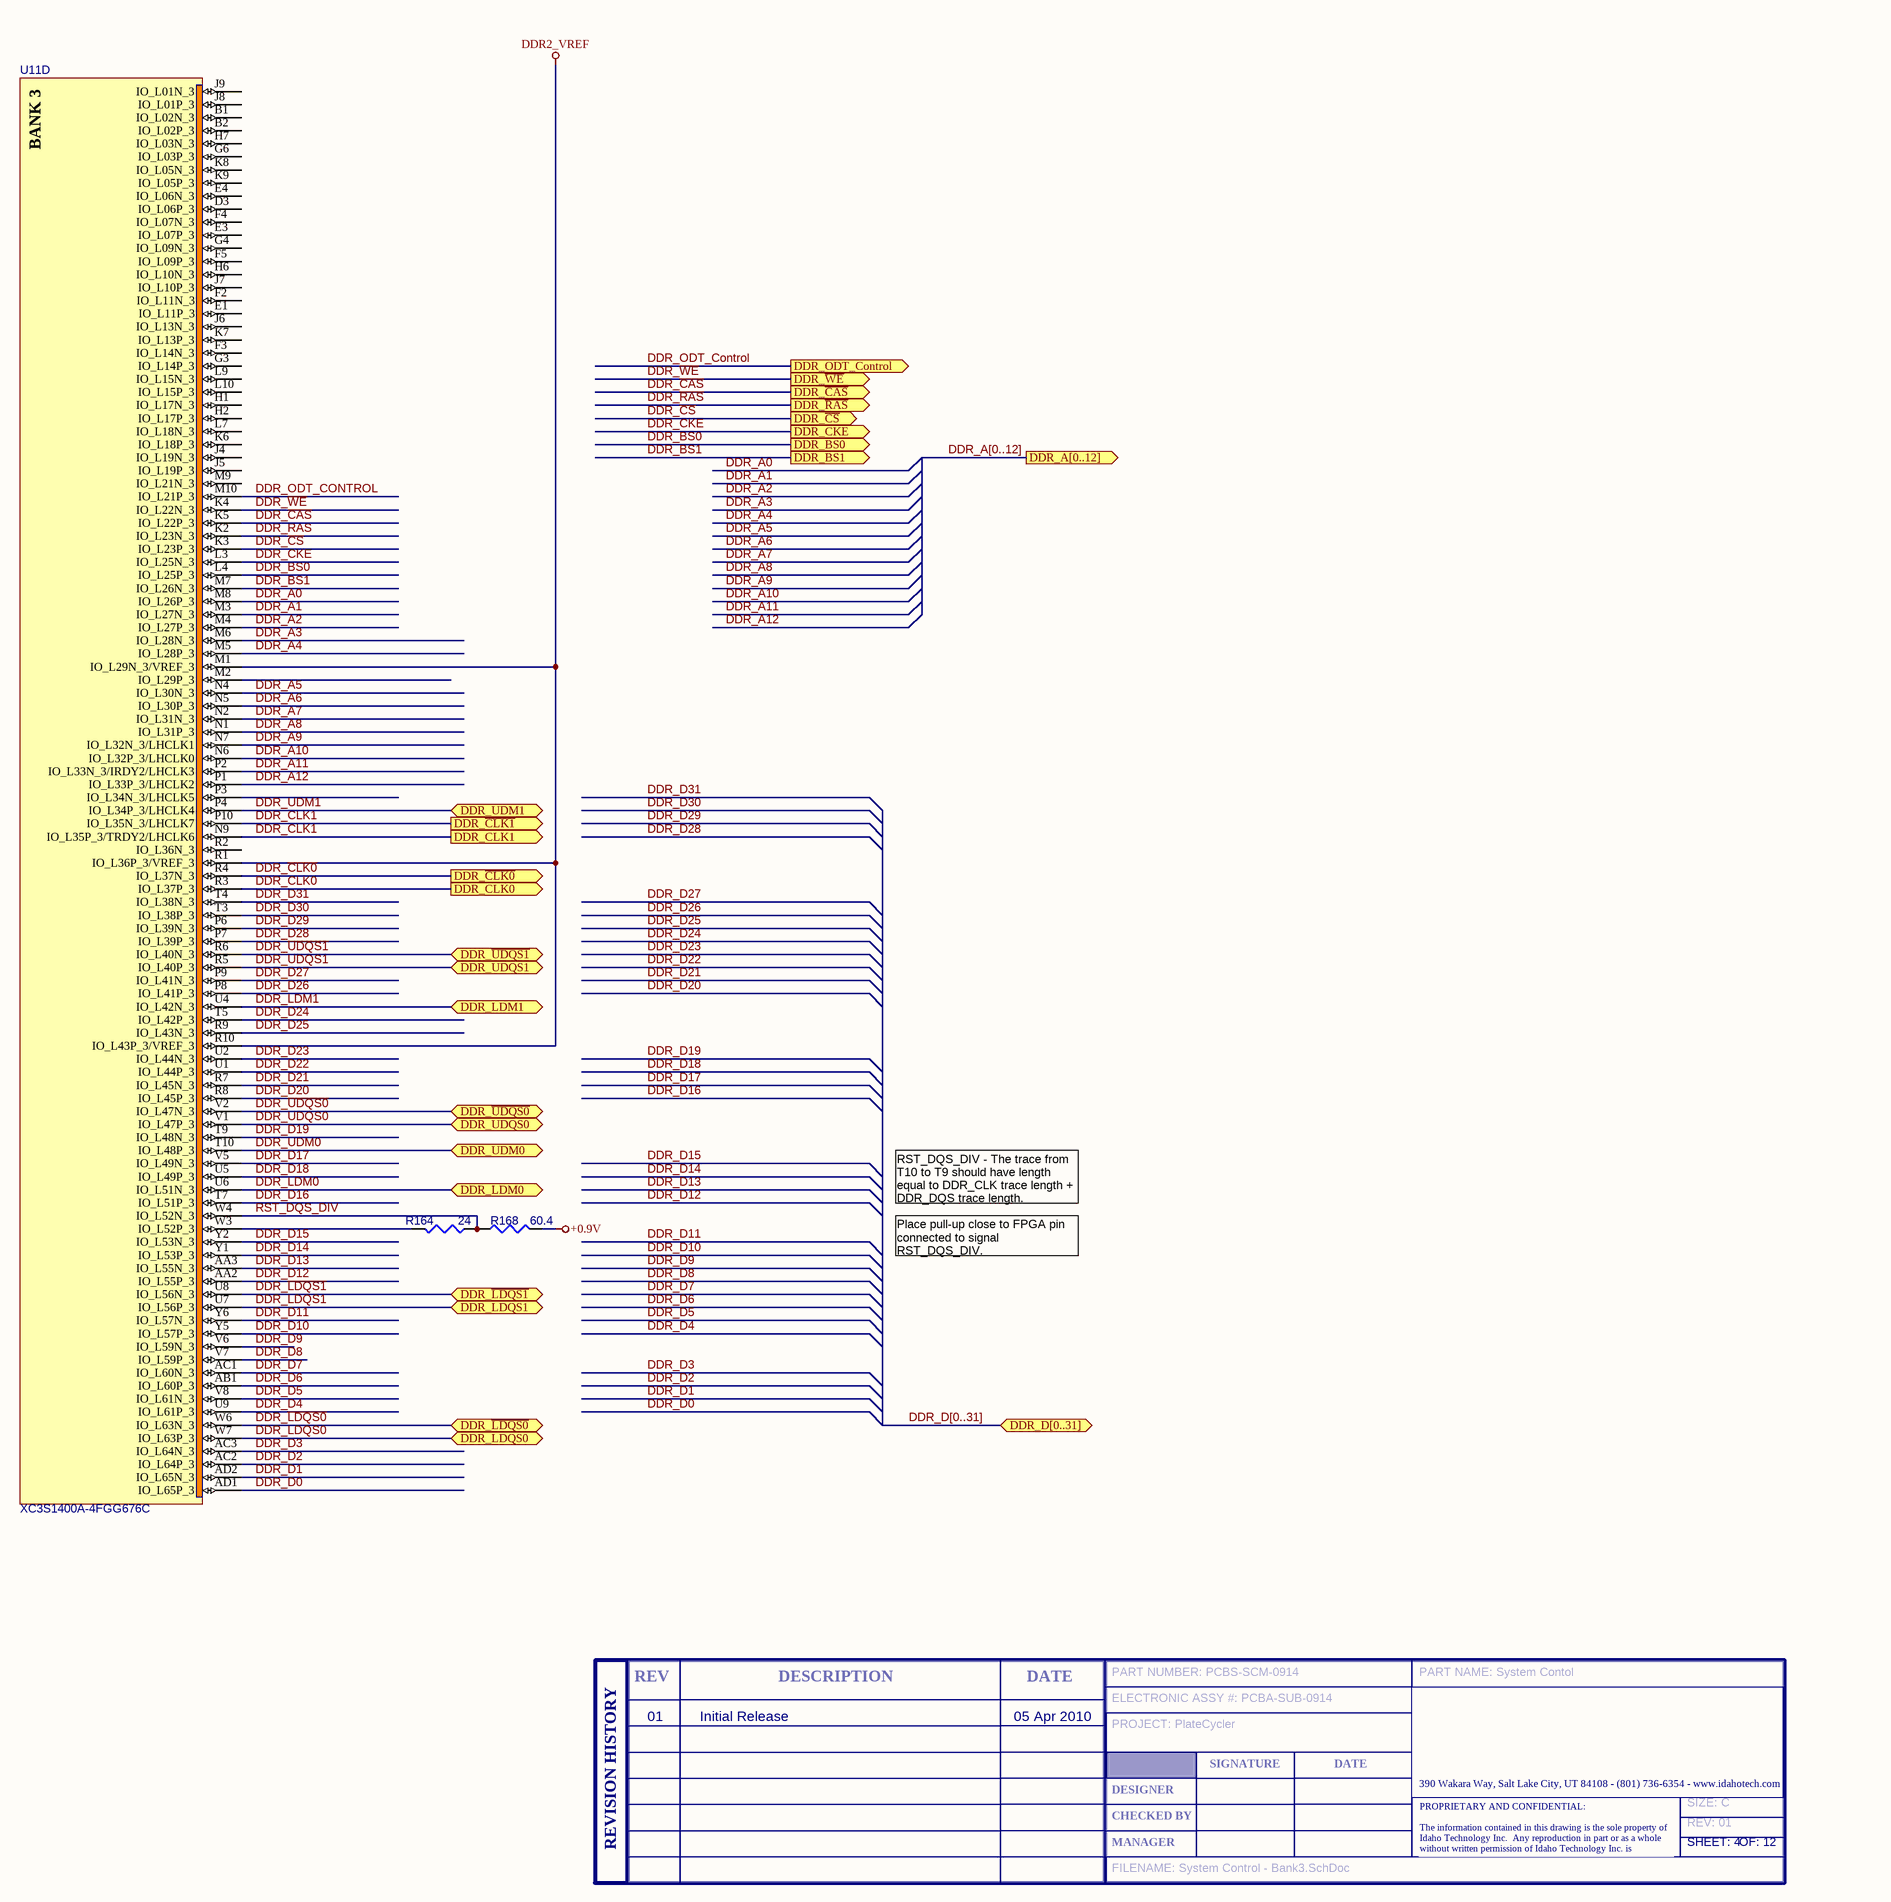
[diagram p3: System Control - Bank3.SchDoc]

### Parts
(Parts that share a designator on the sheet are numbered #1, #2 ... from top to bottom, then left to right.)
R164  24  [SM/R_0402]
R168  60.4  [SM/R_0402]
T?#4  SIZE: C  REV: 01  FILENAME: System Control - Bank3.SchDoc  PART NUMBER: PCBS-SCM-0914  PART NAME: System Contol  ELECTRONIC ASSY #: PCBA-SUB-0914  PROJECT: PlateCycler  SHEET: 4  OF: 12  (hidden comment: ITI Title Block, A Size)  (graphical)
U11  XC3S1400A-4FGG676C  [FGG676]  (part D of 9)

### Ports
DDR_A[0..12] (out), DDR_BS0 (out), DDR_BS1 (out), DDR_CKE (out), DDR_CLK0 (out), DDR_CLK1 (out), DDR_D[0..31] (bidir), DDR_LDM0 (bidir), DDR_LDM1 (bidir), DDR_LDQS0 (bidir), DDR_LDQS1 (bidir), DDR_ODT_Control (out), DDR_UDM0 (bidir), DDR_UDM1 (bidir), DDR_UDQS0 (bidir), DDR_UDQS1 (bidir), DDR_~{CAS} (out), DDR_~{CLK0} (out), DDR_~{CLK1} (out), DDR_~{CS} (out), DDR_~{LDQS0} (bidir), DDR_~{LDQS1} (bidir), DDR_~{RAS} (out), DDR_~{UDQS0} (bidir), DDR_~{UDQS1} (bidir), DDR_~{WE} (out)

### Nets
+0.9V: R168.2
DDR2_VREF: U11.M1(IO_L29N_3/VREF_3) U11.R1(IO_L36P_3/VREF_3) U11.R10(IO_L43P_3/VREF_3)
DDR_A0: U11.M8(IO_L26P_3)
DDR_A1: U11.M3(IO_L27N_3)
DDR_A2: U11.M4(IO_L27P_3)
DDR_A3: U11.M6(IO_L28N_3)
DDR_A4: U11.M5(IO_L28P_3)
DDR_A5: U11.N4(IO_L30N_3)
DDR_A6: U11.N5(IO_L30P_3)
DDR_A7: U11.N2(IO_L31N_3)
DDR_A8: U11.N1(IO_L31P_3)
DDR_A9: U11.N7(IO_L32N_3/LHCLK1)
DDR_A10: U11.N6(IO_L32P_3/LHCLK0)
DDR_A11: U11.P2(IO_L33N_3/IRDY2/LHCLK3)
DDR_A12: U11.P1(IO_L33P_3/LHCLK2)
DDR_BS0: U11.L4(IO_L25P_3) ; port DDR_BS0
DDR_BS1: U11.M7(IO_L26N_3) ; port DDR_BS1
DDR_~{CAS}: U11.K5(IO_L22P_3) ; port DDR_~{CAS}
DDR_~{CLK0}: U11.R4(IO_L37N_3) ; port DDR_~{CLK0}
DDR_~{CLK1}: U11.P10(IO_L35N_3/LHCLK7) ; port DDR_~{CLK1}
DDR_~{CS}: U11.K3(IO_L23P_3) ; port DDR_~{CS}
DDR_CKE: U11.L3(IO_L25N_3) ; port DDR_CKE
DDR_CLK0: U11.R3(IO_L37P_3) ; port DDR_CLK0
DDR_CLK1: U11.N9(IO_L35P_3/TRDY2/LHCLK6) ; port DDR_CLK1
DDR_D0: U11.AD1(IO_L65P_3)
DDR_D1: U11.AD2(IO_L65N_3)
DDR_D2: U11.AC2(IO_L64P_3)
DDR_D3: U11.AC3(IO_L64N_3)
DDR_D4: U11.U9(IO_L61P_3)
DDR_D5: U11.V8(IO_L61N_3)
DDR_D6: U11.AB1(IO_L60P_3)
DDR_D7: U11.AC1(IO_L60N_3)
DDR_D8: U11.V7(IO_L59P_3)
DDR_D9: U11.V6(IO_L59N_3)
DDR_D10: U11.Y5(IO_L57P_3)
DDR_D11: U11.Y6(IO_L57N_3)
DDR_D12: U11.AA2(IO_L55P_3)
DDR_D13: U11.AA3(IO_L55N_3)
DDR_D14: U11.Y1(IO_L53P_3)
DDR_D15: U11.Y2(IO_L53N_3)
DDR_D16: U11.T7(IO_L51P_3)
DDR_D17: U11.V5(IO_L49N_3)
DDR_D18: U11.U5(IO_L49P_3)
DDR_D19: U11.T9(IO_L48N_3)
DDR_D20: U11.R8(IO_L45P_3)
DDR_D21: U11.R7(IO_L45N_3)
DDR_D22: U11.U1(IO_L44P_3)
DDR_D23: U11.U2(IO_L44N_3)
DDR_D24: U11.T5(IO_L42P_3)
DDR_D25: U11.R9(IO_L43N_3)
DDR_D26: U11.P8(IO_L41P_3)
DDR_D27: U11.P9(IO_L41N_3)
DDR_D28: U11.P7(IO_L39P_3)
DDR_D29: U11.P6(IO_L39N_3)
DDR_D30: U11.T3(IO_L38P_3)
DDR_D31: U11.T4(IO_L38N_3)
DDR_~{LDQS0}: U11.W6(IO_L63N_3) ; port DDR_~{LDQS0}
DDR_~{LDQS1}: U11.U8(IO_L56N_3) ; port DDR_~{LDQS1}
DDR_LDM0: U11.U6(IO_L51N_3) ; port DDR_LDM0
DDR_LDM1: U11.U4(IO_L42N_3) ; port DDR_LDM1
DDR_LDQS0: U11.W7(IO_L63P_3) ; port DDR_LDQS0
DDR_LDQS1: U11.U7(IO_L56P_3) ; port DDR_LDQS1
DDR_ODT_Control: U11.M10(IO_L21P_3) ; port DDR_ODT_Control
DDR_~{RAS}: U11.K2(IO_L23N_3) ; port DDR_~{RAS}
DDR_~{UDQS0}: U11.V2(IO_L47N_3) ; port DDR_~{UDQS0}
DDR_~{UDQS1}: U11.R6(IO_L40N_3) ; port DDR_~{UDQS1}
DDR_UDM0: U11.T10(IO_L48P_3) ; port DDR_UDM0
DDR_UDM1: U11.P4(IO_L34P_3/LHCLK4) ; port DDR_UDM1
DDR_UDQS0: U11.V1(IO_L47P_3) ; port DDR_UDQS0
DDR_UDQS1: U11.R5(IO_L40P_3) ; port DDR_UDQS1
DDR_~{WE}: U11.K4(IO_L22N_3) ; port DDR_~{WE}
RST_DQS_DIV: R164.1 R168.1 U11.W4(IO_L52N_3)
NetR164_2: R164.2 U11.W3(IO_L52P_3)

Not connected (* = marked no-connect by the designer): U11 B1(IO_L02N_3) B2(IO_L02P_3) D3(IO_L06P_3) E1(IO_L11P_3) E3(IO_L07P_3) E4(IO_L06N_3) F2(IO_L11N_3) F3(IO_L14N_3) F4(IO_L07N_3) F5(IO_L09P_3) G3(IO_L14P_3) G4(IO_L09N_3) G6(IO_L03P_3) H1(IO_L17N_3) H2(IO_L17P_3) H6(IO_L10N_3) H7(IO_L03N_3) J4(IO_L19N_3) J5(IO_L19P_3) J6(IO_L13N_3) J7(IO_L10P_3) J8(IO_L01P_3) J9(IO_L01N_3) K6(IO_L18P_3) K7(IO_L13P_3) K8(IO_L05N_3) K9(IO_L05P_3) L7(IO_L18N_3) L9(IO_L15N_3) L10(IO_L15P_3) M2(IO_L29P_3) M9(IO_L21N_3) P3(IO_L34N_3/LHCLK5) R2(IO_L36N_3)

### Buses and harness runs
bus DDR_A[0..12] = port DDR_A[0..12]
bus DDR_D[0..31] = port DDR_D[0..31]

### Notes on the sheet
- RST_DQS_DIV - The trace from T10 to T9 should have length equal to DDR_CLK trace length + DDR_DQS trace length.
- Place pull-up close to FPGA pin connected to signal RST_DQS_DIV.
- 01
- Initial Release
- 05 Apr 2010
- (in symbol ITI A-size Title Block and Rev Table) REV; DESCRIPTION; DATE; SIGNATURE; 390 Wakara Way, Salt Lake City, UT 84108 - (801) 736-6354 - www.idahotech.com; DESIGNER; CHECKED BY; REVISION HISTORY; MANAGER; PROPRIETARY AND CONFIDENTIAL: / The information contained in this drawing is the sole property of / Idaho Technology Inc.  Any reproduction in part or as a whole / without written permission of Idaho Technology Inc. is prohibited.
- (in symbol XC3S1400A-4FGG676C, part D) BANK 3

### Library data of the parts
R164 = R1K 5% 0603: RES 24.0 OHM 1/16W 1% 0402 SMD; Manufacturer: Panasonic; Manufacturer P/N: ERJ-2RKF24R0X; Vendor: Digikey; Vendor P/N: P24.0LCT-ND
R168 = R1K 5% 0603: RES 60.4 OHM 1/16W 1% 0402 SMD; Manufacturer: Panasonic; Manufacturer P/N: ERJ-2RKF60R4X; Vendor: Digikey; Vendor P/N: P60.4LCT-ND
T?#4 = ITI A-size Title Block and Rev Table: ITI Title Block and Rev Table, A Size
U11 = XC3S1400A-4FGG676C: as U11 on sheet System Control - Bank1; Published: 12-Dec-2006; DatasheetVersion: 08-May-2007; PackageVersion: ver1.2.1, Apr-2005; PackageReference: FGG676; Publisher: Altium Limited; PackageDescription: 676-Ball Fine Pitch Ball Grid Array (FGG676) - Pb-Free; Code_JEDEC: MS-034-AAL-1; Code_IPC: BGA100P26X26-676; ComponentLink1Description: Manufacturer Link; ComponentLink1URL: http://www.xilinx.com/products/silicon_solutions/fpgas/spartan_series/spartan3a_fpgas/index.htm; ComponentLink2Description: Datasheet; ComponentLink2URL: http://direct.xilinx.com/bvdocs/publications/ds529.pdf